# Altium project Dahlia Carrier Board.PrjPcb (part 3 of 4)

## Sheet Ethernet.SchDoc: Dahlia Carrier Board
size A3; Organization: Toradex AG; Address1: Ebenaustrasse 10; Address2: Horw; Address3: 6048; Address4: Switzerland; DocumentNumber: 7; Revision: V1.1; SheetNumber: 7; SheetTotal: 21; PageSetup: Record=PageOptions|CenterHorizontal=True|CenterVertical=True|PrintScale=0.71|XCorrection=1.00|YCorrection=1.00|PrintKind=1|BorderSize=5000000|LeftOffset=0|BottomOffset=0|Orientation=2|PaperLength=1000|PaperWidth=1000|Scale=100|PaperSource=15|PrintQuality=600|MediaType=1|DitherType=10|PaperKind=A4|PrintScaleMode=1
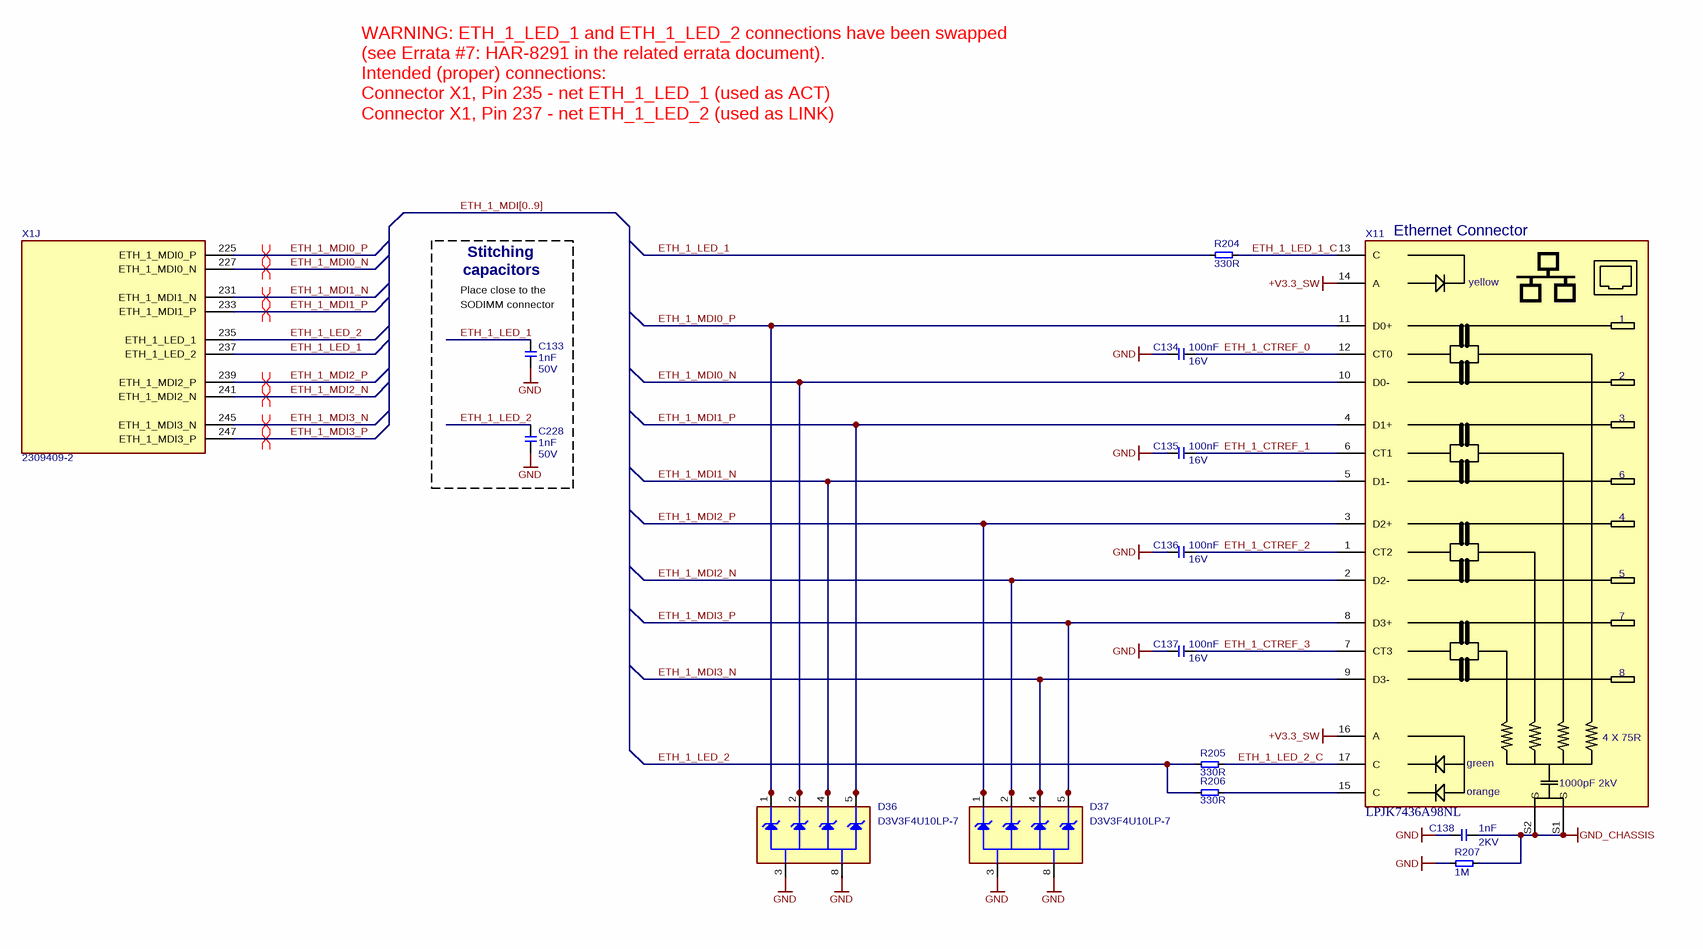
[diagram p10: Ethernet.SchDoc]

### Parts
C133  Rating: 50V  [CAPC1005X60N]  (hidden comment: 1nF)
C134  Rating: 16V  [CAPC1005X60N]  (hidden comment: 100nF)
C135  Rating: 16V  [CAPC1005X60N]  (hidden comment: 100nF)
C136  Rating: 16V  [CAPC1005X60N]  (hidden comment: 100nF)
C137  Rating: 16V  [CAPC1005X60N]  (hidden comment: 100nF)
C138  Rating: 2KV  [T_CAPC1206X180N]  (hidden comment: 1nF)
C228  Rating: 50V  [CAPC1005X60N]  (hidden comment: 1nF)
D36  D3V3F4U10LP-7  [D-Diodes-D3V3F4U10LP-7]
D37  D3V3F4U10LP-7  [D-Diodes-D3V3F4U10LP-7]
R204  330R  [RESC1005X40N]
R205  330R  [RESC1005X40N]
R206  330R  [RESC1005X40N]
R207  1M  [RESC3216X75N]
X1  2309409-2  [CON-TE-2309409-2-SOLDERABLE-STANDOFFS]  (part J of 23)
X11  LPJK7436A98NL  [CON-LINK-PP-LPJK7436A98NL]

### Nets
+V3.3_SW: X11.14(A) X11.16(A)
GND: C133.1 C134.2 C135.2 C136.2 C137.2 C138.1 C228.1 D36.3 D36.8 D37.3 D37.8 R207.2
GND_CHASSIS: C138.2 R207.1 X11.S1(S) X11.S2(S)
ETH_1_CTREF_0: C134.1 X11.12(CT0)
ETH_1_CTREF_1: C135.1 X11.6(CT1)
ETH_1_CTREF_2: C136.1 X11.1(CT2)
ETH_1_CTREF_3: C137.1 X11.7(CT3)
ETH_1_LED_1: C133.2 R204.2 X1.237(ETH_1_LED_2)
ETH_1_LED_1_C: R204.1 X11.13(C)
ETH_1_LED_2: C228.2 R205.2 R206.2 X1.235(ETH_1_LED_1)
ETH_1_LED_2_C: R205.1 X11.17(C)
ETH_1_MDI0_N: D36.2 D36.9 X1.227(ETH_1_MDI0_N) X11.10(D0-)
ETH_1_MDI0_P: D36.1 D36.10 X1.225(ETH_1_MDI0_P) X11.11(D0+)
ETH_1_MDI1_N: D36.4 D36.7 X1.231(ETH_1_MDI1_N) X11.5(D1-)
ETH_1_MDI1_P: D36.5 D36.6 X1.233(ETH_1_MDI1_P) X11.4(D1+)
ETH_1_MDI2_N: D37.2 D37.9 X1.241(ETH_1_MDI2_N) X11.2(D2-)
ETH_1_MDI2_P: D37.1 D37.10 X1.239(ETH_1_MDI2_P) X11.3(D2+)
ETH_1_MDI3_N: D37.4 D37.7 X1.245(ETH_1_MDI3_N) X11.9(D3-)
ETH_1_MDI3_P: D37.5 D37.6 X1.247(ETH_1_MDI3_P) X11.8(D3+)
NetR206_1: R206.1 X11.15(C)

### Buses and harness runs
bus ETH_1_MDI[0..9]

### Layout directives
differential pair; differential pair class LAN: ETH_1_MDI0_N, ETH_1_MDI0_P, ETH_1_MDI1_N, ETH_1_MDI1_P, ETH_1_MDI2_N, ETH_1_MDI2_P, ETH_1_MDI3_N, ETH_1_MDI3_P

### Notes on the sheet
- WARNING: ETH_1_LED_1 and ETH_1_LED_2 connections have been swapped (see Errata #7: HAR-8291 in the related errata document).
  Intended (proper) connections:
  Connector X1, Pin 235 - net ETH_1_LED_1 (used as ACT)
  Connector X1, Pin 237 - net ETH_1_LED_2 (used as LINK)
- (near X11) Ethernet Connector
- (near C133) Place close to the
- (near C133) SODIMM connector
- capacitors
- Stitching
- Title
- Size:
- Date:
- A3
- Number:
- Time:
- Revision:
- Sheet
- of
- File:
- (in symbol CON-ETH-RJ45-1000BaseT) yellow; 4 X 75R; green; 1000pF 2kV; orange

### Library data of the parts
C133 C228 = C-X7R-1nF-50V-10%-0402: Capacitor Ceramic X7R 1nF 50V 10% 0402; Tolerance: 10%; Type: X7R; Value: 1nF
C134-C137 = C-X7R-100nF-16V-10%-0402: Capacitor Ceramic X7R 100nF 16V 10% 0402; Tolerance: 10%; Type: X7R; Value: 100nF
C138 = C-X7R-1nF-2KV-10%-1206: Capacitor Ceramic X7R 1nF 2KV 10% 1206; Tolerance: 10%; Type: X7R; Value: 1nF
D36 D37 = D-Diodes-D3V3F4U10LP-7: as D28 on sheet SDCard; Manufacturer Part No.: D3V3F4U10LP-7
R204-R206 = R-330R-63mW-5%-0402: Resistor 330 ohm 63mW 5% 0402; Rating: 63mW; Tolerance: 5%; Value: 330R
R207 = R-1M-250mW-5%-1206: Resistor 1 Mohm 250mW 5% 1206; Rating: 250mW; Tolerance: 5%; Value: 1M
X1 = CON-TE-2309409-2: as X1 on sheet Power_Switch; Temperature Range: -40C to +125C; Package: DDR4-SODIMM-260; Manufacturer Part No.: 2309409-2
X11 = CON-ETH-RJ45-1000BaseT: 10/100/1000 MBit/s Gigabit Ethernet RJ45 Connector, Low profile, Mag Jack, Temp. Range: -40C to +100C; Manufacturer Name: LINK-PP; Temperature Range: *; Manufacturer Part No.: LPJK7436A98NL

## Sheet PCI_Express.SchDoc: Dahlia Carrier Board
size A3; Organization: Toradex AG; Address1: Ebenaustrasse 10; Address2: Horw; Address3: 6048; Address4: Switzerland; DocumentNumber: 8; Revision: V1.1; SheetNumber: 8; SheetTotal: 21; PageSetup: Record=PageOptions|CenterHorizontal=True|CenterVertical=True|PrintScale=0.71|XCorrection=1.00|YCorrection=1.00|PrintKind=1|BorderSize=5000000|LeftOffset=0|BottomOffset=0|Orientation=2|PaperLength=1000|PaperWidth=1000|Scale=100|PaperSource=15|PrintQuality=600|MediaType=1|DitherType=10|PaperKind=A4|PrintScaleMode=1
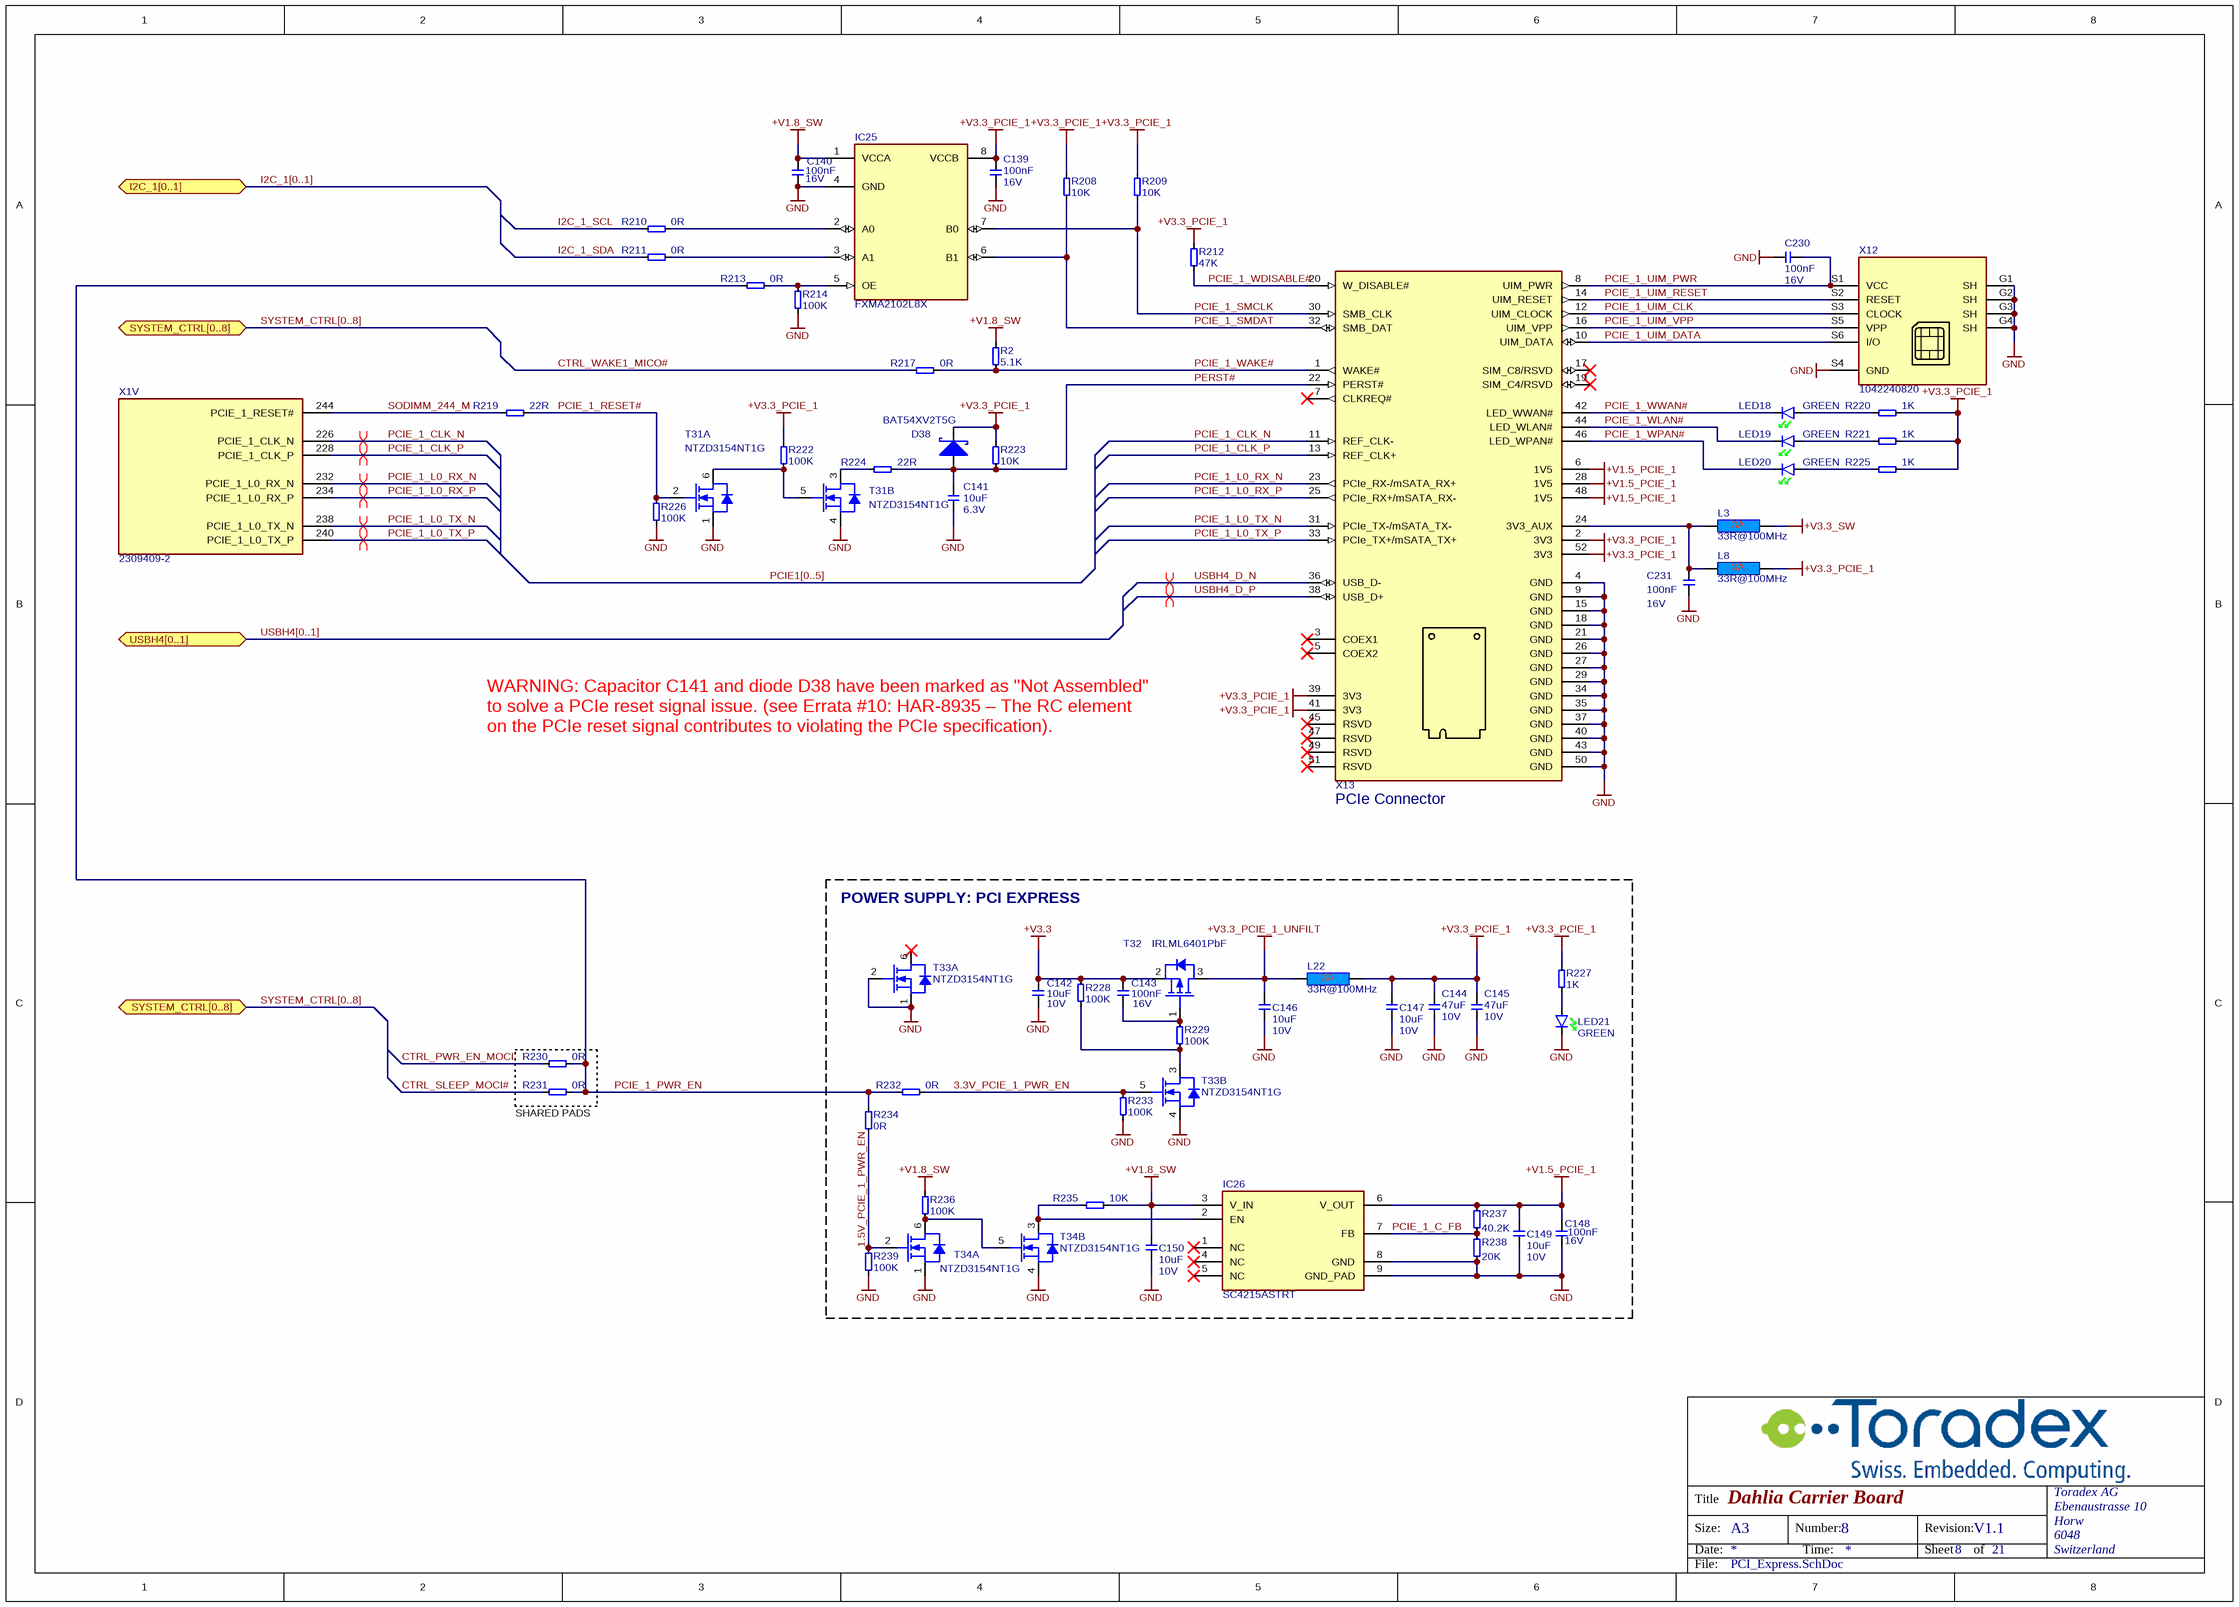
[diagram p11: PCI_Express.SchDoc]

### Parts
C139  Rating: 16V  [CAPC1005X60N]  (hidden comment: 100nF)
C140  Rating: 16V  [CAPC1005X60N]  (hidden comment: 100nF)
C141  Rating: 6.3V  [CAPC1005X60N]  (hidden comment: 10uF)
C142  Rating: 10V  [T_CAPC0603X33N]  (hidden comment: 10uF)
C143  Rating: 16V  [CAPC1005X60N]  (hidden comment: 100nF)
C144  Rating: 10V  [T_CAPC0805X125N]  (hidden comment: 47uF)
C145  Rating: 10V  [T_CAPC0805X125N]  (hidden comment: 47uF)
C146  Rating: 10V  [T_CAPC0603X33N]  (hidden comment: 10uF)
C147  Rating: 10V  [T_CAPC0603X33N]  (hidden comment: 10uF)
C148  Rating: 16V  [CAPC1005X60N]  (hidden comment: 100nF)
C149  Rating: 10V  [T_CAPC0603X33N]  (hidden comment: 10uF)
C150  Rating: 10V  [T_CAPC0603X33N]  (hidden comment: 10uF)
C230  Rating: 16V  [CAPC1005X60N]  (hidden comment: 100nF)
C231  Rating: 16V  [CAPC1005X60N]  (hidden comment: 100nF)
D38  BAT54XV2T5G  [SOD-523]
IC25  FXMA2102L8X  [IC-MicroPak50P160X2160X55-8N]
IC26  Manufacturer Part No.: SC4215ASTRT  [IC-SOIC127P650X175_HS-8N]  (hidden comment: IC-Semtech-SC4215A)
L3  33R@100MHz  [INDC1608X95N]
L8  33R@100MHz  [INDC1608X95N]
L22  33R@100MHz  [INDC1608X95N]
LED18  Color: GREEN  [T_Liteon_LTST-C190GKT]  (hidden comment: LTST-C190GKT)
LED19  Color: GREEN  [T_Liteon_LTST-C190GKT]  (hidden comment: LTST-C190GKT)
LED20  Color: GREEN  [T_Liteon_LTST-C190GKT]  (hidden comment: LTST-C190GKT)
LED21  Color: GREEN  [T_Liteon_LTST-C190GKT]  (hidden comment: LTST-C190GKT)
R2  5.1K  [T_RESC0603X30N]
R208  10K  [RESC1005X40N]
R209  10K  [RESC1005X40N]
R210  0R  [T_RESC0603X30N]
R211  0R  [T_RESC0603X30N]
R212  47K  [RESC1005X40N]
R213  0R  [T_RESC0603X30N]
R214  100K  [RESC1005X40N]
R217  0R  [T_RESC0603X30N]
R219  22R  [RESC1005X40N]
R220  1K  [RESC1005X40N]
R221  1K  [RESC1005X40N]
R222  100K  [RESC1005X40N]
R223  10K  [RESC1005X40N]
R224  22R  [RESC1005X40N]
R225  1K  [RESC1005X40N]
R226  100K  [RESC1005X40N]
R227  1K  [RESC1005X40N]
R228  100K  [RESC1005X40N]
R229  100K  [RESC1005X40N]
R230  0R  [T_RESC0603X30N]
R231  0R  [T_RESC0603X30N]
R232  0R  [T_RESC0603X30N]
R233  100K  [RESC1005X40N]
R234  0R  [T_RESC0603X30N]
R235  10K  [RESC1005X40N]
R236  100K  [RESC1005X40N]
R237  40.2K  [RESC1005X40N]
R238  20K  [RESC1005X40N]
R239  100K  [RESC1005X40N]
T31  Manufacturer Part No.: NTZD3154NT1G  [SOTFL50P160X60-6N]  (hidden comment: T-ONSemi-NTZD3154NT1G)  (parts A,B of 2)
T32  IRLML6401PbF  [SOT95P237X112-3N]
T33  Manufacturer Part No.: NTZD3154NT1G  [SOTFL50P160X60-6N]  (hidden comment: T-ONSemi-NTZD3154NT1G)  (parts A,B of 2)
T34  Manufacturer Part No.: NTZD3154NT1G  [SOTFL50P160X60-6N]  (hidden comment: T-ONSemi-NTZD3154NT1G)  (parts A,B of 2)
X1  2309409-2  [CON-TE-2309409-2-SOLDERABLE-STANDOFFS]  (part V of 23)
X12  1042240820  [T_Molex_1042240820]
X13  67910-5700  [CON-Molex-67910-5700-Half/Full]  (value not drawn)

### Blocks framed on the sheet
POWER SUPPLY: PCI EXPRESS: C142-C150 IC26 L22 LED21 R227-R229 R232-R239 T32-T34

### Ports
I2C_1[0..1] (bidir), SYSTEM_CTRL[0..8] (bidir), USBH4[0..1] (bidir)

### Nets
+V1.5_PCIE_1: C148.2 C149.2 IC26.6(V_OUT) R237.2 X13.6(1V5) X13.28(1V5) X13.48(1V5)
+V1.8_SW: C140.2 C150.2 IC25.1(VCCA) IC26.3(V_IN) R2.1 R235.1 R236.2
+V3.3: C142.2 C143.2 R228.2 T32.2(S)
+V3.3_PCIE_1: C139.2 C144.2 C145.2 C147.2 D38.C IC25.8(VCCB) L8.2 L22.2 R208.2 R209.2 R212.2 R220.1 R221.1 R222.2 R223.2 R225.1 R227.2 X13.2(3V3) X13.39(3V3) X13.41(3V3) X13.52(3V3)
+V3.3_PCIE_1_UNFILT: C146.2 L22.1 T32.3(D)
+V3.3_SW: L3.2
GND: C139.1 C140.1 C141.1 C142.1 C144.1 C145.1 C146.1 C147.1 C148.1 C149.1 C150.1 C230.1 C231.1 IC25.4(GND) IC26.8(GND) IC26.9(GND_PAD) LED21.K R214.1 R226.1 R233.1 R238.1 R239.1 T31.1(S) T31.4(S) T33.1(S) T33.2(G) T33.4(S) T34.1(S) T34.4(S) X12.G1(SH) X12.G2(SH) X12.G3(SH) X12.G4(SH) X12.S4(GND) X13.4(GND) X13.9(GND) X13.15(GND) X13.18(GND) X13.21(GND) X13.26(GND) X13.27(GND) X13.29(GND) X13.34(GND) X13.35(GND) X13.37(GND) X13.40(GND) X13.43(GND) X13.50(GND)
1.5V_PCIE_1_PWR_EN: R234.1 R239.2 T34.2(G)
3.3V_PCIE_1_PWR_EN: R232.2 R233.2 T33.5(G)
CTRL_PWR_EN_MOCI: R230.1
CTRL_SLEEP_MOCI#: R231.1
CTRL_WAKE1_MICO#: R217.1
I2C_1_SCL: R210.1
I2C_1_SDA: R211.1
PCIE_1_C_FB: IC26.7(FB) R237.1 R238.2
PCIE_1_CLK_N: X1.226(PCIE_1_CLK_N) X13.11(REF_CLK-)
PCIE_1_CLK_P: X1.228(PCIE_1_CLK_P) X13.13(REF_CLK+)
PCIE_1_L0_RX_N: X1.232(PCIE_1_L0_RX_N) X13.23(PCIe_RX-/mSATA_RX+)
PCIE_1_L0_RX_P: X1.234(PCIE_1_L0_RX_P) X13.25(PCIe_RX+/mSATA_RX-)
PCIE_1_L0_TX_N: X1.238(PCIE_1_L0_TX_N) X13.31(PCIe_TX-/mSATA_TX-)
PCIE_1_L0_TX_P: X1.240(PCIE_1_L0_TX_P) X13.33(PCIe_TX+/mSATA_TX+)
PCIE_1_PWR_EN: R213.1 R230.2 R231.2 R232.1 R234.2
PCIE_1_RESET#: R219.2 R226.2 T31.2(G)
PCIE_1_SMCLK: IC25.7(B0) R209.1 X13.30(SMB_CLK)
PCIE_1_SMDAT: IC25.6(B1) R208.1 X13.32(SMB_DAT)
PCIE_1_UIM_CLK: X12.S3(CLOCK) X13.12(UIM_CLOCK)
PCIE_1_UIM_DATA: X12.S6(I/O) X13.10(UIM_DATA)
PCIE_1_UIM_PWR: C230.2 X12.S1(VCC) X13.8(UIM_PWR)
PCIE_1_UIM_RESET: X12.S2(RESET) X13.14(UIM_RESET)
PCIE_1_UIM_VPP: X12.S5(VPP) X13.16(UIM_VPP)
PCIE_1_WAKE#: R2.2 R217.2 X13.1(WAKE#)
PCIE_1_WDISABLE#: R212.1 X13.20(W_DISABLE#)
PCIE_1_WLAN#: LED19.K X13.44(LED_WLAN#)
PCIE_1_WPAN#: LED20.K X13.46(LED_WPAN#)
PCIE_1_WWAN#: LED18.K X13.42(LED_WWAN#)
PERST#: C141.2 D38.A R223.1 R224.2 X13.22(PERST#)
SODIMM_244_M: R219.1 X1.244(PCIE_1_RESET#)
USBH4_D_N: X13.36(USB_D-)
USBH4_D_P: X13.38(USB_D+)
NetC143_1: C143.1 R229.2 T32.1(G)
NetC231_2: C231.2 L3.1 L8.1 X13.24(3V3_AUX)
NetIC25_2: IC25.2(A0) R210.2
NetIC25_3: IC25.3(A1) R211.2
NetIC25_5: IC25.5(OE) R213.2 R214.2
NetIC26_2: IC26.2(EN) R235.2 T34.3(D)
NetLED18_A: LED18.A R220.2
NetLED19_A: LED19.A R221.2
NetLED20_A: LED20.A R225.2
NetLED21_A: LED21.A R227.1
NetR222_1: R222.1 T31.5(G) T31.6(D)
NetR224_1: R224.1 T31.3(D)
NetR228_1: R228.1 R229.1 T33.3(D)
NetR236_1: R236.1 T34.5(G) T34.6(D)

Not connected (* = marked no-connect by the designer): IC26 1(NC)* 4(NC)* 5(NC)*; T33 6(D)*; X13 3(COEX1)* 5(COEX2)* 7(CLKREQ#)* 17(SIM_C8/RSVD)* 19(SIM_C4/RSVD)* 45(RSVD)* 47(RSVD)* 49(RSVD)* 51(RSVD)*

### Buses and harness runs
bus I2C_1[0..1] = port I2C_1[0..1]
bus PCIE1[0..5]
bus SYSTEM_CTRL[0..8] = port SYSTEM_CTRL[0..8]
bus USBH4[0..1] = port USBH4[0..1]

### Layout directives
differential pair; differential pair class PCIe: PCIE_1_CLK_N, PCIE_1_CLK_P, PCIE_1_L0_RX_N, PCIE_1_L0_RX_P, PCIE_1_L0_TX_N, PCIE_1_L0_TX_P
differential pair; differential pair class USB: USBH4_D_N, USBH4_D_P

### Notes on the sheet
- WARNING: Capacitor C141 and diode D38 have been marked as "Not Assembled" to solve a PCIe reset signal issue. (see Errata #10: HAR-8935 – The RC element on the PCIe reset signal contributes to violating the PCIe specification).
- (near X13) PCIe Connector
- (near R231) SHARED PADS
- Title
- Size:
- Date:
- A3
- Number:
- Time:
- Revision:
- Sheet
- of
- File:

### Library data of the parts
C139 C140 C143 C148 C230 C231 = C-X7R-100nF-16V-10%-0402: Capacitor Ceramic X7R 100nF 16V 10% 0402; Tolerance: 10%; Type: X7R; Value: 100nF
C141 = C-X5R-10u-6.3V-20%-0402: Capacitor Ceramic X5R 10uF 6.3V 20% 0402; Tolerance: 20%; Type: X5R; Value: 10uF
C142 C146 C147 C149 C150 = C-X5R-10uF-10V-20%-0603: Capacitor Ceramic X5R 10uF 10V 20% 0603; Tolerance: 20%; Type: X5R; Value: 10uF
C144 C145 = C-X5R-47uF-10V-20%-0805: Capacitor Ceramic X5R 47uF 10V 20% 0805; Tolerance: 20%; Type: X5R; Value: 47uF
D38 = D-BAT54-SOD523: Schottky Barrier Rectifier; Manufacturer Name: On Semi; Manufacturer Part No.: BAT54XV2T5G
IC25 = IC-ONsemi-FXMA2102L8X: Voltage Level Translator for I2C Applications; Manufacturer Name: ONSemi; Manufacturer Part No.: FXMA2102L8X
IC26 = IC-Semtech-SC4215A: LDO TO 2A; Manufacturer Name: Semtech; Package: *; Temperature Range: *
L3 L8 L22 = L-33R@100MHz-3A-25%-0603: 33R@100MHz 3A EMI FILTER; Tolerance: 25%; Rating: 3A; Value: 33R@100MHz
LED18-LED21 = LED-LiteOn-LTST-C190GKT: LED green Lite-ON LTST-C190GKT; Manufacturer Name: Lite-ON; Manufacturer Part No.: LTST-C190GKT
R2 = R-5.1K-63mW-1%-0603: Resistor 5.1 Kohm 63mW 1% 0603; Rating: 63mW; Tolerance: 1%; Value: 5.1K
R208 R209 R223 R235 = R-10K-63mW-5%-0402: Resistor 10 Kohm 63mW 5% 0402; Rating: 63mW; Tolerance: 5%; Value: 10K
R210 R211 R213 R217 R230-R232 R234 = R-0R-63mW-1%-0603: Resistor 0 ohm 63mW 1% 0603; Rating: 63mW; Tolerance: 1%; Value: 0R
R212 = R-47K-63mW-1%-0402: Resistor 47 Kohm 63mW 1% 0402; Rating: 63mW; Tolerance: 1%; Value: 47K
R214 R222 R226 R228 R229 R233 R236 R239 = R-100K-63mW-5%-0402: Resistor 100 Kohm 63mW 5% 0402; Rating: 63mW; Tolerance: 5%; Value: 100K
R219 R224 = R-22R-63mW-5%-0402: Resistor 22 ohm 63mW 5% 0402; Rating: 63mW; Tolerance: 5%; Value: 22R
R220 R221 R225 R227 = R-1K-63mW-5%-0402: Resistor 1 Kohm 63mW 5% 0402; Rating: 63mW; Tolerance: 5%; Value: 1K
R237 = R-40.2KR-63mW-1%-0402: Resistor 40.2 Kohm 63mW 1% 0402; Value: 40.2KR; Rating: 63mW; Tolerance: 1%
R238 = R-20KR-63mW-1%-0402: Resistor 20 Kohm 63mW 1% 0402; Value: 20KR; Rating: 63mW; Tolerance: 1%
T31 T33 T34 = T-ONSemi-NTZD3154NT1G: Dual N-Channel 20V (D-S)  MOSFET; Manufacturer Name: ONSemi
T32 = T-IR-IRLML6401PbF-SOT-23: p-channel MOSFET, IRLML6401PbF; Manufacturer Name: International Rectifier; Manufacturer Part No.: IRLML6401PbF
X1 = CON-TE-2309409-2: DDR4 SODIMM Socket, 260 pins, 5.2mm(H), 0.5mm Pitch; Manufacturer Name: TE; Temperature Range: -40C to +125C; Package: DDR4-SODIMM-260; Manufacturer Part No.: 2309409-2
X12 = CON-Molex-1042240820: 6 Contacts Nano Sim Card Holder; Manufacturer Name: Molex; Manufacturer Part No.: 1042240820
X13 = CON-Molex-67910-5700: PCIe_Mini Card Holder; Manufacturer Name: Molex; Manufacturer Part No.: 67910-5700

## Sheet Audio.SchDoc: Dahlia Carrier Board
size A3; Organization: Toradex AG; Address1: Ebenaustrasse 10; Address2: Horw; Address3: 6048; Address4: Switzerland; DocumentNumber: 15; Revision: V1.1; SheetNumber: 15; SheetTotal: 21; PageSetup: Record=PageOptions|CenterHorizontal=True|CenterVertical=True|PrintScale=0.71|XCorrection=1.00|YCorrection=1.00|PrintKind=1|BorderSize=5000000|LeftOffset=0|BottomOffset=0|Orientation=2|PaperLength=1000|PaperWidth=1000|Scale=100|PaperSource=15|PrintQuality=600|MediaType=1|DitherType=10|PaperKind=A4|PrintScaleMode=1
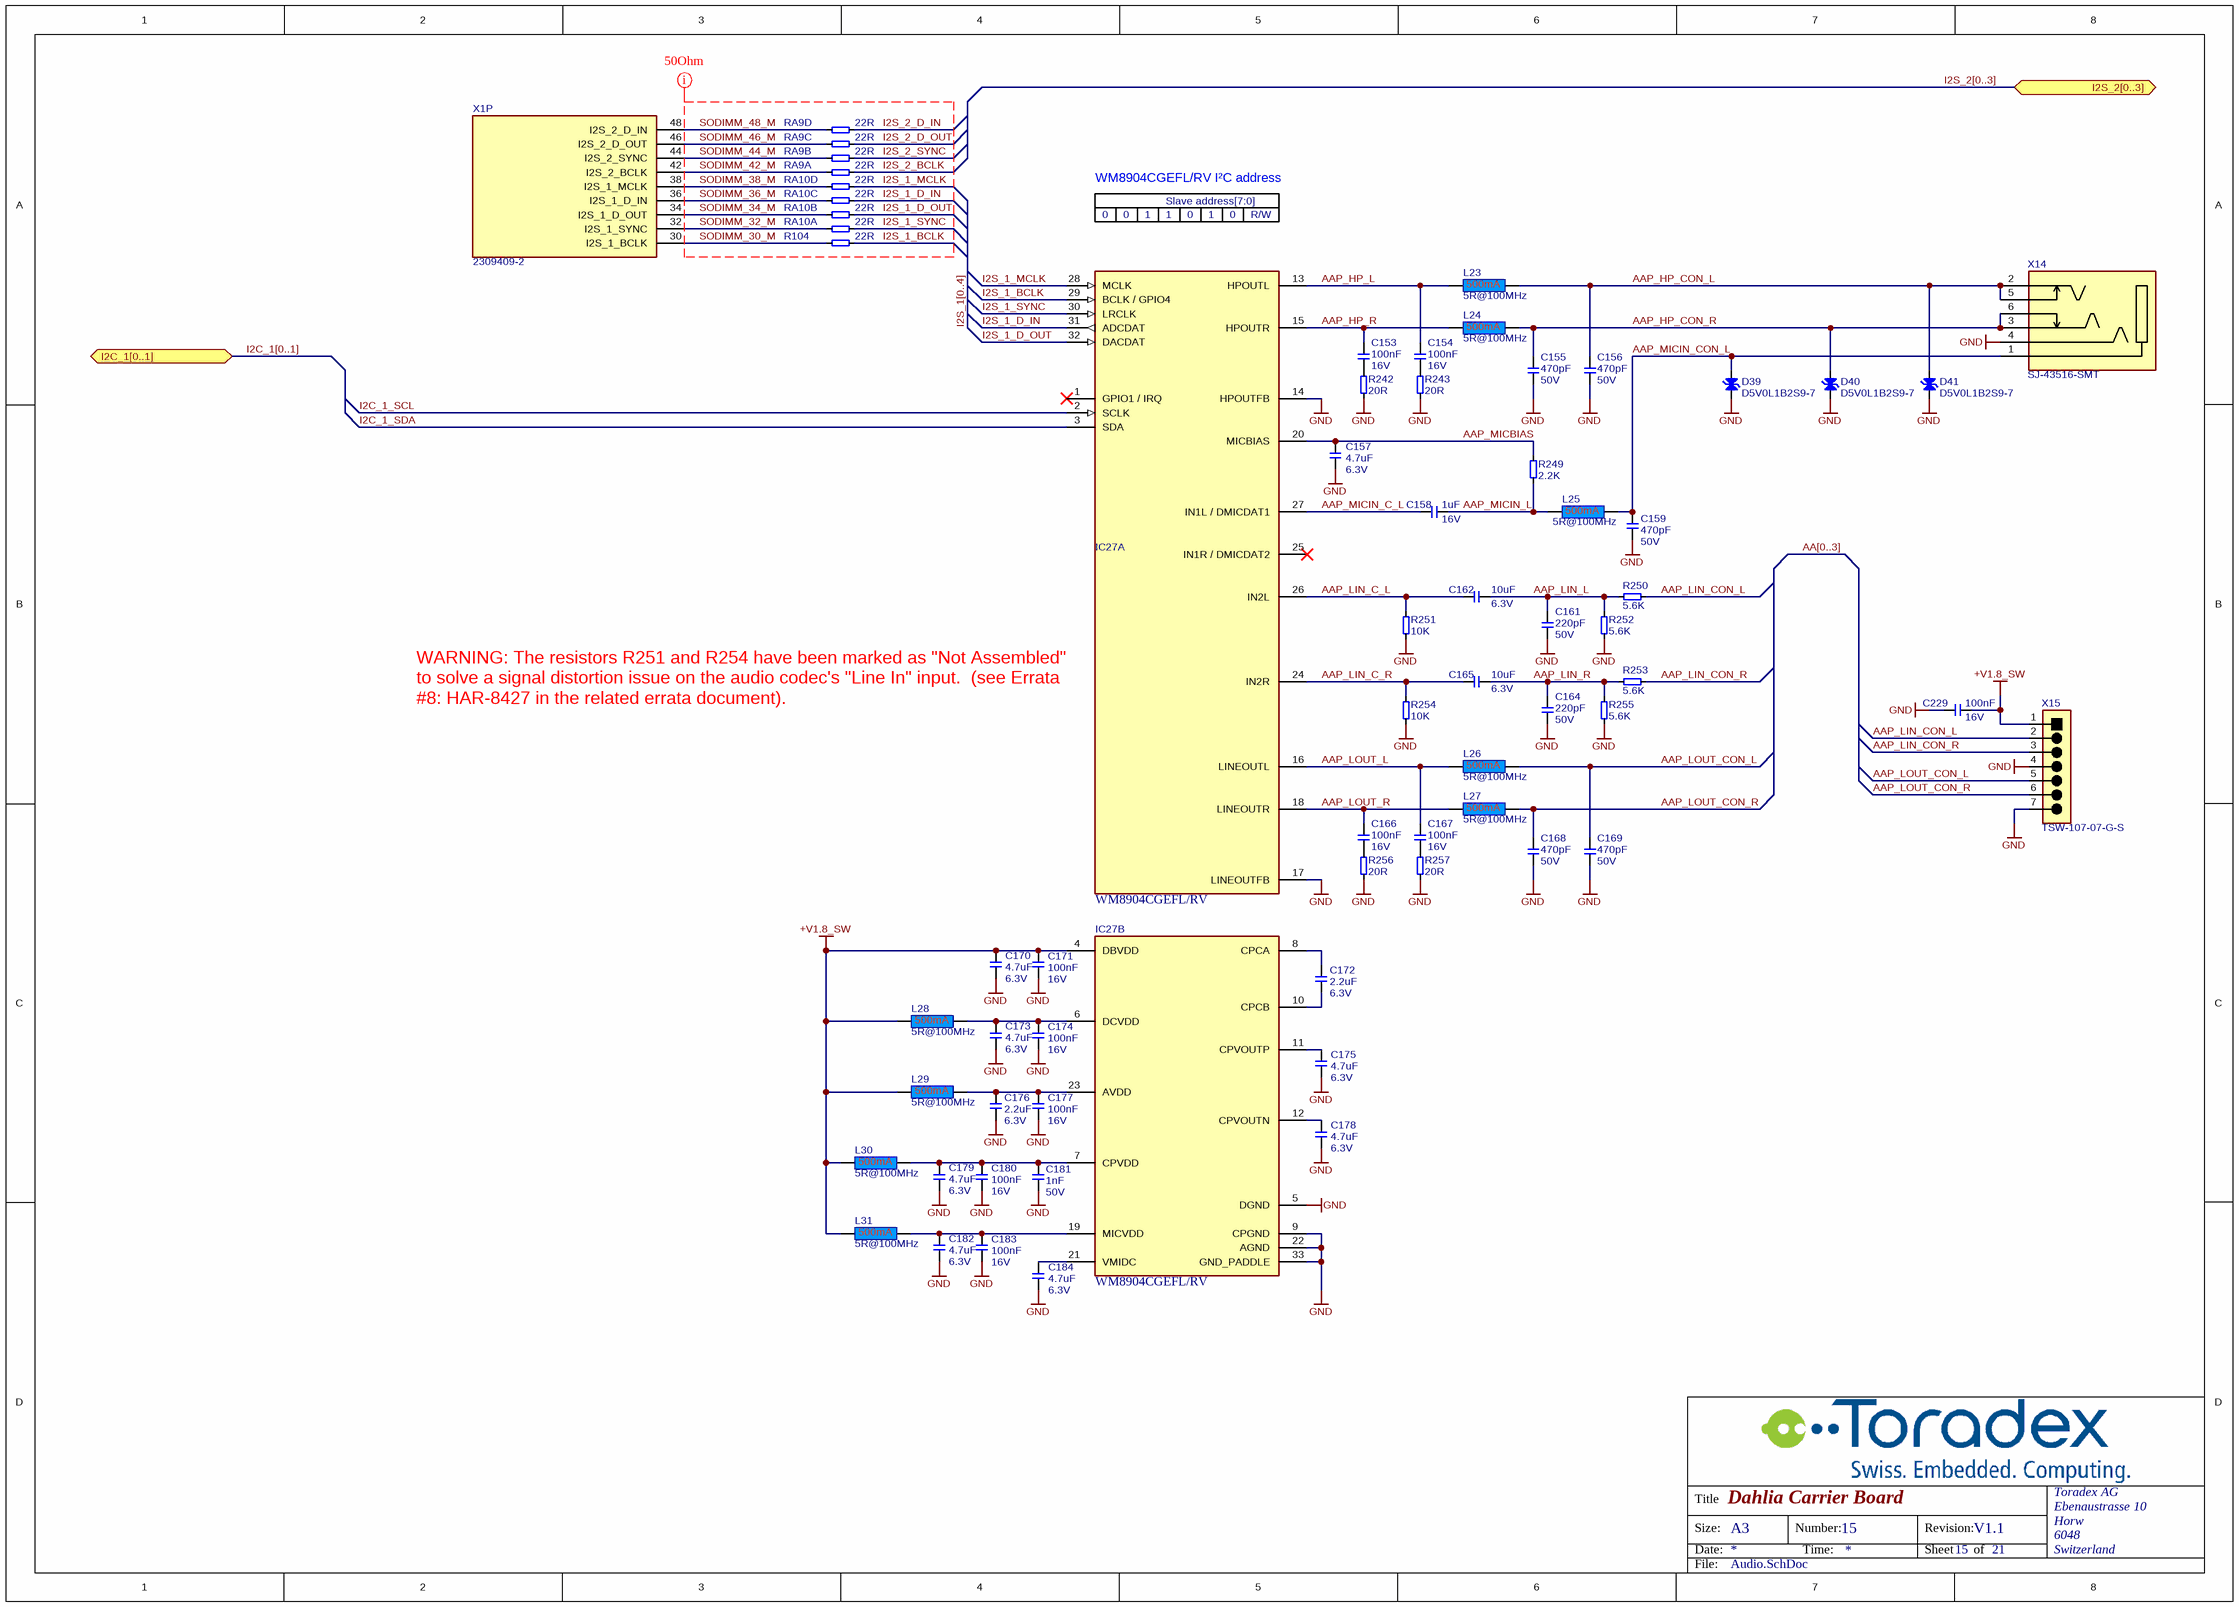
[diagram p12: Audio.SchDoc]

### Parts
C153  Rating: 16V  [CAPC1005X60N]  (hidden comment: 100nF)
C154  Rating: 16V  [CAPC1005X60N]  (hidden comment: 100nF)
C155  Rating: 50V  [CAPC1005X60N]  (hidden comment: 470pF)
C156  Rating: 50V  [CAPC1005X60N]  (hidden comment: 470pF)
C157  Rating: 6.3V  [CAPC1005X60N]  (hidden comment: 4.7uF)
C158  Rating: 16V  [CAPC1005X60N]  (hidden comment: 1uF)
C159  Rating: 50V  [CAPC1005X60N]  (hidden comment: 470pF)
C161  Rating: 50V  [CAPC1005X60N]  (hidden comment: 220pF)
C162  Rating: 6.3V  [CAPC1005X60N]  (hidden comment: 10uF)
C164  Rating: 50V  [CAPC1005X60N]  (hidden comment: 220pF)
C165  Rating: 6.3V  [CAPC1005X60N]  (hidden comment: 10uF)
C166  Rating: 16V  [CAPC1005X60N]  (hidden comment: 100nF)
C167  Rating: 16V  [CAPC1005X60N]  (hidden comment: 100nF)
C168  Rating: 50V  [CAPC1005X60N]  (hidden comment: 470pF)
C169  Rating: 50V  [CAPC1005X60N]  (hidden comment: 470pF)
C170  Rating: 6.3V  [CAPC1005X60N]  (hidden comment: 4.7uF)
C171  Rating: 16V  [CAPC1005X60N]  (hidden comment: 100nF)
C172  Rating: 6.3V  [CAPC1005X60N]  (hidden comment: 2.2uF)
C173  Rating: 6.3V  [CAPC1005X60N]  (hidden comment: 4.7uF)
C174  Rating: 16V  [CAPC1005X60N]  (hidden comment: 100nF)
C175  Rating: 6.3V  [CAPC1005X60N]  (hidden comment: 4.7uF)
C176  Rating: 6.3V  [CAPC1005X60N]  (hidden comment: 2.2uF)
C177  Rating: 16V  [CAPC1005X60N]  (hidden comment: 100nF)
C178  Rating: 6.3V  [CAPC1005X60N]  (hidden comment: 4.7uF)
C179  Rating: 6.3V  [CAPC1005X60N]  (hidden comment: 4.7uF)
C180  Rating: 16V  [CAPC1005X60N]  (hidden comment: 100nF)
C181  Rating: 50V  [CAPC1005X60N]  (hidden comment: 1nF)
C182  Rating: 6.3V  [CAPC1005X60N]  (hidden comment: 4.7uF)
C183  Rating: 16V  [CAPC1005X60N]  (hidden comment: 100nF)
C184  Rating: 6.3V  [CAPC1005X60N]  (hidden comment: 4.7uF)
C229  Rating: 16V  [CAPC1005X60N]  (hidden comment: 100nF)
D39  D5V0L1B2S9-7  [D-DIODES-SOD-923]
D40  D5V0L1B2S9-7  [D-DIODES-SOD-923]
D41  D5V0L1B2S9-7  [D-DIODES-SOD-923]
IC27  WM8904CGEFL/RV  [IC-QFN40P400X400X80_HS-33N]  (parts A,B of 2)
L23  5R@100MHz  [INDC1005X60N]
L24  5R@100MHz  [INDC1005X60N]
L25  5R@100MHz  [INDC1005X60N]
L26  5R@100MHz  [INDC1005X60N]
L27  5R@100MHz  [INDC1005X60N]
L28  5R@100MHz  [INDC1005X60N]
L29  5R@100MHz  [INDC1005X60N]
L30  5R@100MHz  [INDC1005X60N]
L31  5R@100MHz  [INDC1005X60N]
R104  22R  [RESC1005X40N]
R242  20R  [RESC1005X40N]
R243  20R  [RESC1005X40N]
R249  2.2K  [RESC1005X40N]
R250  5.6K  [RESC1005X40N]
R251  10K  [RESC1005X40N]
R252  5.6K  [RESC1005X40N]
R253  5.6K  [RESC1005X40N]
R254  10K  [RESC1005X40N]
R255  5.6K  [RESC1005X40N]
R256  20R  [RESC1005X40N]
R257  20R  [RESC1005X40N]
RA9  22R  [T_Resistor_Array_X4]  (parts A,B,C,D of 4)
RA10  22R  [T_Resistor_Array_X4]  (parts A,B,C,D of 4)
X1  2309409-2  [CON-TE-2309409-2-SOLDERABLE-STANDOFFS]  (part P of 23)
X14  SJ-43516-SMT  [T_CI_SJ-43516-SMT]
X15  TSW-107-07-G-S  [T_Samtec_TSW-107-07-G-S]

### Ports
I2C_1[0..1] (bidir), I2S_2[0..3] (bidir)

### Nets
+V1.8_SW: C170.2 C171.2 C229.1 IC27.4(DBVDD) L28.1 L29.1 L30.1 L31.1 X15.1
GND: C155.1 C156.1 C157.1 C159.1 C161.1 C164.1 C168.1 C169.1 C170.1 C171.1 C173.1 C174.1 C175.1 C176.1 C177.1 C178.1 C179.1 C180.1 C181.1 C182.1 C183.1 C184.1 C229.2 D39.1(C) D40.1(C) D41.1(C) IC27.5(DGND) IC27.9(CPGND) IC27.14(HPOUTFB) IC27.17(LINEOUTFB) IC27.22(AGND) IC27.33(GND_PADDLE) R242.1 R243.1 R251.1 R252.1 R254.1 R255.1 R256.1 R257.1 X14.4 X15.4 X15.7
AAP_HP_CON_L: C156.2 D41.2(A) L23.2 X14.2 X14.5
AAP_HP_CON_R: C155.2 D40.2(A) L24.2 X14.3 X14.6
AAP_HP_L: C154.2 IC27.13(HPOUTL) L23.1
AAP_HP_R: C153.2 IC27.15(HPOUTR) L24.1
AAP_LIN_C_L: C162.2 IC27.26(IN2L) R251.2
AAP_LIN_C_R: C165.2 IC27.24(IN2R) R254.2
AAP_LIN_CON_L: R250.1 X15.2
AAP_LIN_CON_R: R253.1 X15.3
AAP_LIN_L: C161.2 C162.1 R250.2 R252.2
AAP_LIN_R: C164.2 C165.1 R253.2 R255.2
AAP_LOUT_CON_L: C169.2 L26.2 X15.5
AAP_LOUT_CON_R: C168.2 L27.2 X15.6
AAP_LOUT_L: C167.2 IC27.16(LINEOUTL) L26.1
AAP_LOUT_R: C166.2 IC27.18(LINEOUTR) L27.1
AAP_MICBIAS: C157.2 IC27.20(MICBIAS) R249.2
AAP_MICIN_C_L: C158.1 IC27.27(IN1L_/_DMICDAT1)
AAP_MICIN_CON_L: C159.2 D39.2(A) L25.2 X14.1
AAP_MICIN_L: C158.2 L25.1 R249.1
I2C_1_SCL: IC27.2(SCLK)
I2C_1_SDA: IC27.3(SDA)
I2S_1_BCLK: IC27.29(BCLK_/_GPIO4) R104.2
I2S_1_D_IN: IC27.31(ADCDAT) RA10.7
I2S_1_D_OUT: IC27.32(DACDAT) RA10.6
I2S_1_MCLK: IC27.28(MCLK) RA10.8
I2S_1_SYNC: IC27.30(LRCLK) RA10.5
I2S_2_BCLK: RA9.5
I2S_2_D_IN: RA9.8
I2S_2_D_OUT: RA9.7
I2S_2_SYNC: RA9.6
SODIMM_30_M: R104.1 X1.30(I2S_1_BCLK)
SODIMM_32_M: RA10.1 X1.32(I2S_1_SYNC)
SODIMM_34_M: RA10.2 X1.34(I2S_1_D_OUT)
SODIMM_36_M: RA10.3 X1.36(I2S_1_D_IN)
SODIMM_38_M: RA10.4 X1.38(I2S_1_MCLK)
SODIMM_42_M: RA9.1 X1.42(I2S_2_BCLK)
SODIMM_44_M: RA9.2 X1.44(I2S_2_SYNC)
SODIMM_46_M: RA9.3 X1.46(I2S_2_D_OUT)
SODIMM_48_M: RA9.4 X1.48(I2S_2_D_IN)
NetC153_1: C153.1 R242.2
NetC154_1: C154.1 R243.2
NetC166_1: C166.1 R256.2
NetC167_1: C167.1 R257.2
NetC172_1: C172.1 IC27.10(CPCB)
NetC172_2: C172.2 IC27.8(CPCA)
NetC173_2: C173.2 C174.2 IC27.6(DCVDD) L28.2
NetC175_2: C175.2 IC27.11(CPVOUTP)
NetC176_2: C176.2 C177.2 IC27.23(AVDD) L29.2
NetC178_2: C178.2 IC27.12(CPVOUTN)
NetC179_2: C179.2 C180.2 C181.2 IC27.7(CPVDD) L30.2
NetC182_2: C182.2 C183.2 IC27.19(MICVDD) L31.2
NetC184_2: C184.2 IC27.21(VMIDC)

Not connected (* = marked no-connect by the designer): IC27 1(GPIO1_/_IRQ)* 25(IN1R_/_DMICDAT2)*

### Buses and harness runs
bus AA[0..3]
bus I2C_1[0..1] = port I2C_1[0..1]
bus I2S_1[0..4]
bus I2S_2[0..3] = port I2S_2[0..3]

### Layout directives
net class 50Ohm: I2S_1_BCLK, I2S_1_D_IN, I2S_1_D_OUT, I2S_1_MCLK, I2S_1_SYNC, I2S_2_BCLK, I2S_2_D_IN, I2S_2_D_OUT, I2S_2_SYNC, SODIMM_30_M, SODIMM_32_M, SODIMM_34_M, SODIMM_36_M, SODIMM_38_M, SODIMM_42_M, SODIMM_44_M, SODIMM_46_M, SODIMM_48_M

### Notes on the sheet
- WM8904CGEFL/RV I²C address
- Slave address[7:0]
- 0
- 1
- R/W
- (near IC27) WARNING: The resistors R251 and R254 have been marked as "Not Assembled" to solve a signal distortion issue on the audio codec's "Line In" input.  (see Errata #8: HAR-8427 in the related errata document).
- Title
- Size:
- Date:
- A3
- Number:
- Time:
- Revision:
- Sheet
- of
- File:

### Library data of the parts
C153 C154 C166 C167 C171 C174 C177 C180 C183 C229 = C-X7R-100nF-16V-10%-0402: Capacitor Ceramic X7R 100nF 16V 10% 0402; Tolerance: 10%; Type: X7R; Value: 100nF
C155 C156 C159 C168 C169 = C-X7R-470p-50V-10%-0402: Capacitor Ceramic X7R 470pF 50V 10% 0402; Tolerance: 10%; Type: X7R; Value: 470pF
C157 C170 C173 C175 C178 C179 C182 C184 = C-X5R-4.7u-6.3V-20%-0402: Capacitor Ceramic X5R 4.7uF 6.3V 20% 0402; Tolerance: 20%; Type: X5R; Value: 4.7uF
C158 = C-X5R-1uF-16V-20%-0402: Capacitor Ceramic X5R 1uF 16V 20% 0402; Tolerance: 20%; Type: X5R; Value: 1uF
C161 C164 = C-X7R-220pF-50V-10%-0402: Capacitor Ceramic X7R  220pF 50V 10% 0402; Tolerance: 10%; Type: X7R; Value: 220pF
C162 C165 = C-X5R-10u-6.3V-20%-0402: Capacitor Ceramic X5R 10uF 6.3V 20% 0402; Tolerance: 20%; Type: X5R; Value: 10uF
C172 C176 = C-X5R-2.2u-6.3V-20%-0402: Capacitor Ceramic X5R 2.2uF 6.3V 20% 0402; Tolerance: 20%; Type: X5R; Value: 2.2uF
C181 = C-X7R-1nF-50V-10%-0402: Capacitor Ceramic X7R 1nF 50V 10% 0402; Tolerance: 10%; Type: X7R; Value: 1nF
D39-D41 = D-Diodes-D5V0L1B2S9-7: BIDIRECTIONAL TVS DIODE 5V  SOD923; Manufacturer Name: Diodes; Manufacturer Part No.: D5V0L1B2S9-7
IC27 = IC-CIRRUS-WM8904CGEFL/RV: Stereo Audio Interface IC; Manufacturer Name: CIRRUS; Package: *; Temperature Range: *; Manufacturer Part No.: WM8904CGEFL/RV
L23-L31 = Lemv-5R-500mA-25%-0402: 5R@100MHz 500mA EMI FILTER; Manufacturer Part No.: BLM15BB050SN1D; Manufacturer: Murata; Tolerance: 25%; Rating: 500mA; Value: 5R@100MHz
R104 = R-22R-63mW-5%-0402: Resistor 22 ohm 63mW 5% 0402; Rating: 63mW; Tolerance: 5%; Value: 22R
R242 R243 R256 R257 = R-20R-63mW-5%-0402: Resistor 20 ohm 63mW 5% 0402; Rating: 63mW; Tolerance: 5%; Value: 20R
R249 = R-2.2K-63mW-5%-0402: Resistor 2.2 Kohm 63mW 5% 0402; Value: 2.2KR; Rating: 63mW; Tolerance: 5%
R250 R252 R253 R255 = R-5.6K-63mW-5%-0402: Resistor 5.6 Kohm 63mW 5% 0402; Value: 5.6KR; Rating: 63mW; Tolerance: 5%
R251 R254 = R-10K-63mW-5%-0402: Resistor 10 Kohm 63mW 5% 0402; Rating: 63mW; Tolerance: 5%; Value: 10K
RA9 RA10 = RA-22R-63mW-5%-1206-div: Resistor Array 22 R 63mW 5% 1206; Tolerance: 5%; Power Dissipation: 63mW; Value: 22R
X1 = CON-TE-2309409-2: as X1 on sheet PCI_Express; Temperature Range: -40C to +125C; Package: DDR4-SODIMM-260; Manufacturer Part No.: 2309409-2
X14 = CON-Cui-SJ-43516-SMT-6-3.5mm: 3.5mm Stereo Jack SMD With Detect Contact; Manufacturer Name: Cui INC; No. of ways: 6; Manufacturer Part No.: SJ-43516-SMT
X15 = CON-Samtec-TSW-107-07-G-S: Header male, 1X7 Pins, 2.54 mm pitch; Manufacturer Name: Samtec; Pitch: 2.54 mm; No. of ways: 1X7; Manufacturer Part No.: TSW-107-07-G-S

## Sheet MIPI-DSI.SchDoc: Dahlia Carrier Board
size A3; Organization: Toradex AG; Address1: Ebenaustrasse 10; Address2: Horw; Address3: 6048; Address4: Switzerland; DocumentNumber: 10; Revision: V1.1; SheetNumber: 10; SheetTotal: 21; PageSetup: Record=PageOptions|CenterHorizontal=True|CenterVertical=True|PrintScale=0.71|XCorrection=1.00|YCorrection=1.00|PrintKind=1|BorderSize=5000000|LeftOffset=0|BottomOffset=0|Orientation=2|PaperLength=1000|PaperWidth=1000|Scale=100|PaperSource=15|PrintQuality=600|MediaType=1|DitherType=10|PaperKind=A4|PrintScaleMode=1
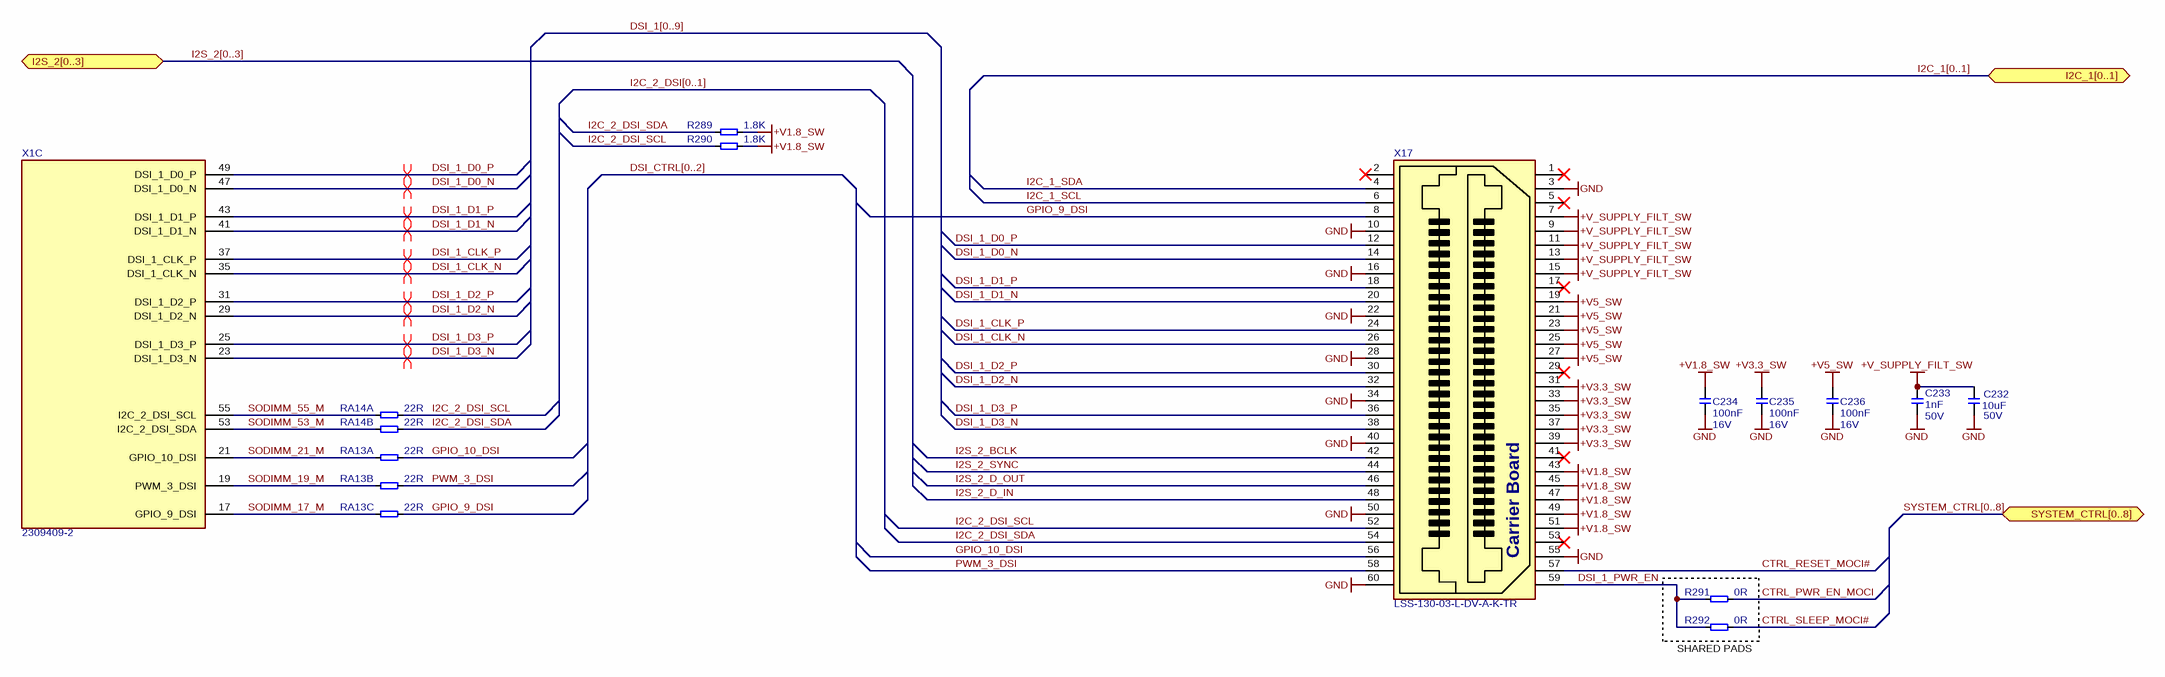
[diagram p13: MIPI-DSI.SchDoc]

### Parts
C232  Rating: 50V  [T_CAPC1206X60N]  (hidden comment: 10uF)
C233  Rating: 50V  [CAPC1005X60N]  (hidden comment: 1nF)
C234  Rating: 16V  [CAPC1005X60N]  (hidden comment: 100nF)
C235  Rating: 16V  [CAPC1005X60N]  (hidden comment: 100nF)
C236  Rating: 16V  [CAPC1005X60N]  (hidden comment: 100nF)
R289  1.8K  [RESC1005X40N]
R290  1.8K  [RESC1005X40N]
R291  0R  [T_RESC0603X30N]
R292  0R  [T_RESC0603X30N]
RA13  22R  [T_Resistor_Array_X4]  (parts A,B,C of 4)
RA14  22R  [T_Resistor_Array_X4]  (parts A,B of 4)
X1  2309409-2  [CON-TE-2309409-2-SOLDERABLE-STANDOFFS]  (part C of 23)
X17  LSS-130-03-L-DV-A-K-TR  [CON-SAMTEC-LSS-130-03-L-DV-A-CARRIER]

### Ports
I2C_1[0..1] (bidir), I2S_2[0..3] (bidir), SYSTEM_CTRL[0..8] (bidir)

### Nets
+V1.8_SW: C234.2 R289.1 R290.1 X17.43 X17.45 X17.47 X17.49 X17.51
+V3.3_SW: C235.2 X17.31 X17.33 X17.35 X17.37 X17.39
+V5_SW: C236.2 X17.19 X17.21 X17.23 X17.25 X17.27
+V_SUPPLY_FILT_SW: C232.2 C233.2 X17.7 X17.9 X17.11 X17.13 X17.15
GND: C232.1 C233.1 C234.1 C235.1 C236.1 X17.3 X17.10 X17.16 X17.22 X17.28 X17.34 X17.40 X17.50 X17.55 X17.60
CTRL_PWR_EN_MOCI: R291.2
CTRL_RESET_MOCI#: X17.57
CTRL_SLEEP_MOCI#: R292.2
DSI_1_CLK_N: X1.35(DSI_1_CLK_N) X17.26
DSI_1_CLK_P: X1.37(DSI_1_CLK_P) X17.24
DSI_1_D0_N: X1.47(DSI_1_D0_N) X17.14
DSI_1_D0_P: X1.49(DSI_1_D0_P) X17.12
DSI_1_D1_N: X1.41(DSI_1_D1_N) X17.20
DSI_1_D1_P: X1.43(DSI_1_D1_P) X17.18
DSI_1_D2_N: X1.29(DSI_1_D2_N) X17.32
DSI_1_D2_P: X1.31(DSI_1_D2_P) X17.30
DSI_1_D3_N: X1.23(DSI_1_D3_N) X17.38
DSI_1_D3_P: X1.25(DSI_1_D3_P) X17.36
DSI_1_PWR_EN: R291.1 R292.1 X17.59
GPIO_9_DSI: RA13.7 X17.8
GPIO_10_DSI: RA13.5 X17.56
I2C_1_SCL: X17.6
I2C_1_SDA: X17.4
I2C_2_DSI_SCL: R290.2 RA14.5 X17.52
I2C_2_DSI_SDA: R289.2 RA14.6 X17.54
I2S_2_BCLK: X17.42
I2S_2_D_IN: X17.48
I2S_2_D_OUT: X17.46
I2S_2_SYNC: X17.44
PWM_3_DSI: RA13.6 X17.58
SODIMM_17_M: RA13.3 X1.17(GPIO_9_DSI)
SODIMM_19_M: RA13.2 X1.19(PWM_3_DSI)
SODIMM_21_M: RA13.1 X1.21(GPIO_10_DSI)
SODIMM_53_M: RA14.2 X1.53(I2C_2_DSI_SDA)
SODIMM_55_M: RA14.1 X1.55(I2C_2_DSI_SCL)

Not connected (* = marked no-connect by the designer): X17 1* 2* 5* 17* 29* 41* 53*

### Buses and harness runs
bus DSI_1[0..9]
bus DSI_CTRL[0..2]
bus I2C_1[0..1] = port I2C_1[0..1]
bus I2C_2_DSI[0..1]
bus I2S_2[0..3] = port I2S_2[0..3]
bus SYSTEM_CTRL[0..8] = port SYSTEM_CTRL[0..8]

### Layout directives
differential pair; differential pair class DSI: DSI_1_CLK_N, DSI_1_CLK_P, DSI_1_D0_N, DSI_1_D0_P, DSI_1_D1_N, DSI_1_D1_P, DSI_1_D2_N, DSI_1_D2_P, DSI_1_D3_N, DSI_1_D3_P

### Notes on the sheet
- (near R292) SHARED PADS
- Title
- Size:
- Date:
- A3
- Number:
- Time:
- Revision:
- Sheet
- of
- File:
- (in symbol CON-Samtec-LSS-130-03-L-DV-A-K-TR-CARRIER) Carrier Board

### Library data of the parts
C232 = C-X5R-10uF-50V-20%-1206: Capacitor Ceramic X5R 10uF 50V 20% 1206; Tolerance: 20%; Type: X5R; Value: 10uF
C233 = C-X7R-1nF-50V-10%-0402: Capacitor Ceramic X7R 1nF 50V 10% 0402; Tolerance: 10%; Type: X7R; Value: 1nF
C234-C236 = C-X7R-100nF-16V-10%-0402: Capacitor Ceramic X7R 100nF 16V 10% 0402; Tolerance: 10%; Type: X7R; Value: 100nF
R289 R290 = R-1.8K-63mW-5%-0402: Resistor 1.8 Kohm 63mW 5% 0402; Rating: 63mW; Tolerance: 5%; Value: 1.8K
R291 R292 = R-0R-63mW-1%-0603: Resistor 0 ohm 63mW 1% 0603; Rating: 63mW; Tolerance: 1%; Value: 0R
RA13 RA14 = RA-22R-63mW-5%-1206-div: Resistor Array 22 R 63mW 5% 1206; Tolerance: 5%; Power Dissipation: 63mW; Value: 22R
X1 = CON-TE-2309409-2: as X1 on sheet PCI_Express; Temperature Range: -40C to +125C; Package: DDR4-SODIMM-260; Manufacturer Part No.: 2309409-2
X17 = CON-Samtec-LSS-130-03-L-DV-A-K-TR-CARRIER: 60 Position Connector, Self Mating, Non-Gendered, Surface Mount; Manufacturer Name: Samtec; Pitch: 0.635mm; No. of ways: 60; Manufacturer Part No.: LSS-130-03-L-DV-A-K-TR

## Sheet MIPI-CSI.SchDoc: Dahlia Carrier Board
size A3; Organization: Toradex AG; Address1: Ebenaustrasse 10; Address2: Horw; Address3: 6048; Address4: Switzerland; DocumentNumber: 11; Revision: V1.1; SheetNumber: 11; SheetTotal: 21; PageSetup: Record=PageOptions|CenterHorizontal=True|CenterVertical=True|PrintScale=0.71|XCorrection=1.00|YCorrection=1.00|PrintKind=1|BorderSize=5000000|LeftOffset=0|BottomOffset=0|Orientation=2|PaperLength=1000|PaperWidth=1000|Scale=100|PaperSource=15|PrintQuality=600|MediaType=1|DitherType=10|PaperKind=A4|PrintScaleMode=1
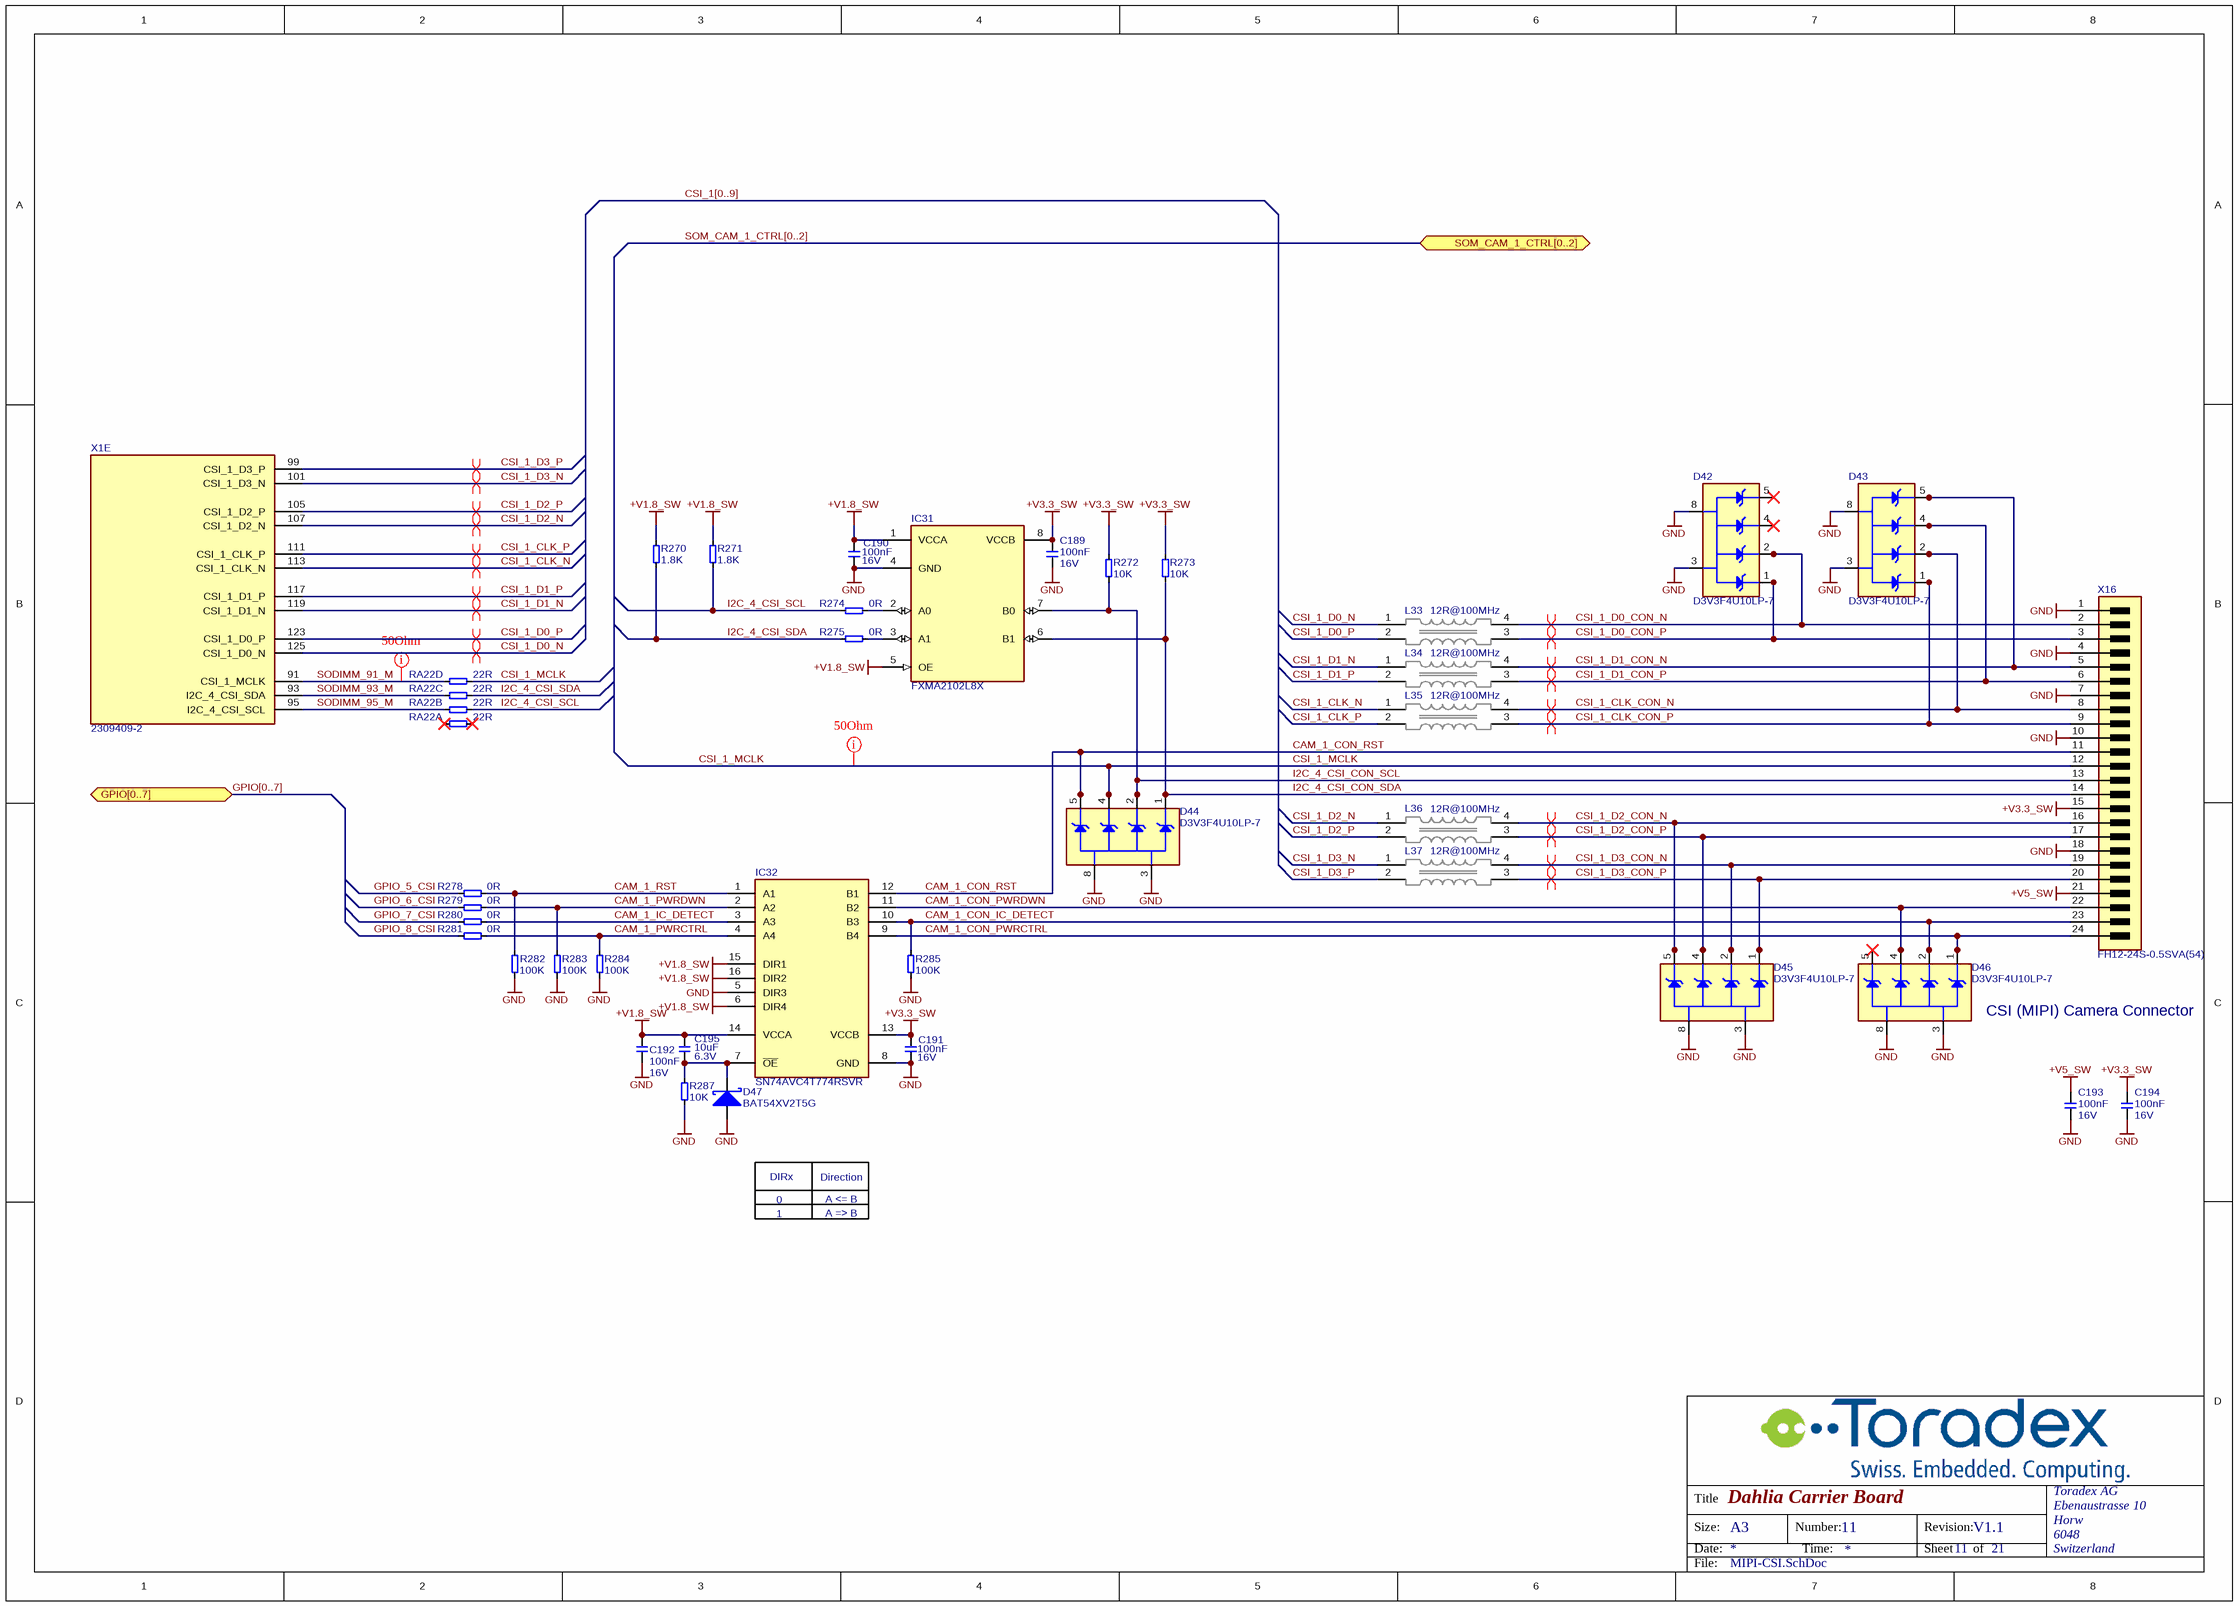
[diagram p14: MIPI-CSI.SchDoc]

### Parts
C189  Rating: 16V  [CAPC1005X60N]  (hidden comment: 100nF)
C190  Rating: 16V  [CAPC1005X60N]  (hidden comment: 100nF)
C191  Rating: 16V  [CAPC1005X60N]  (hidden comment: 100nF)
C192  Rating: 16V  [CAPC1005X60N]  (hidden comment: 100nF)
C193  Rating: 16V  [CAPC1005X60N]  (hidden comment: 100nF)
C194  Rating: 16V  [CAPC1005X60N]  (hidden comment: 100nF)
C195  Rating: 6.3V  [CAPC1005X60N]  (hidden comment: 10uF)
D42  D3V3F4U10LP-7  [D-Diodes-D3V3F4U10LP-7]
D43  D3V3F4U10LP-7  [D-Diodes-D3V3F4U10LP-7]
D44  D3V3F4U10LP-7  [D-Diodes-D3V3F4U10LP-7]
D45  D3V3F4U10LP-7  [D-Diodes-D3V3F4U10LP-7]
D46  D3V3F4U10LP-7  [D-Diodes-D3V3F4U10LP-7]
D47  BAT54XV2T5G  [SOD-523]
IC31  FXMA2102L8X  [IC-MicroPak50P160X2160X55-8N]
IC32  SN74AVC4T774RSVR  [IC-UQFN40P180X210X55-16N]
L33  12R@100MHz  [T_Panasonic_EXC14CH120U]
L34  12R@100MHz  [T_Panasonic_EXC14CH120U]
L35  12R@100MHz  [T_Panasonic_EXC14CH120U]
L36  12R@100MHz  [T_Panasonic_EXC14CH120U]
L37  12R@100MHz  [T_Panasonic_EXC14CH120U]
R270  1.8K  [RESC1005X40N]
R271  1.8K  [RESC1005X40N]
R272  10K  [RESC1005X40N]
R273  10K  [RESC1005X40N]
R274  0R  [T_RESC0603X30N]
R275  0R  [T_RESC0603X30N]
R278  0R  [T_RESC0603X30N]
R279  0R  [T_RESC0603X30N]
R280  0R  [T_RESC0603X30N]
R281  0R  [T_RESC0603X30N]
R282  100K  [RESC1005X40N]
R283  100K  [RESC1005X40N]
R284  100K  [RESC1005X40N]
R285  100K  [RESC1005X40N]
R287  10K  [RESC1005X40N]
RA22  22R  [T_Resistor_Array_X4]  (parts A,B,C,D of 4)
X1  2309409-2  [CON-TE-2309409-2-SOLDERABLE-STANDOFFS]  (part E of 23)
X16  FH12-24S-0.5SVA(54)  [T_Hirose_FH12-24S-0.5SVA(54)]

### Ports
GPIO[0..7] (bidir), SOM_CAM_1_CTRL[0..2] (bidir)

### Nets
+V1.8_SW: C190.2 C192.2 C195.2 IC31.1(VCCA) IC31.5(OE) IC32.6(DIR4) IC32.14(VCCA) IC32.15(DIR1) IC32.16(DIR2) R270.1 R271.1
+V3.3_SW: C189.2 C191.2 C194.2 IC31.8(VCCB) IC32.13(VCCB) R272.2 R273.2 X16.15(DDC_CLK)
+V5_SW: C193.2 X16.21(GND)
GND: C189.1 C190.1 C191.1 C192.1 C193.1 C194.1 D42.3 D42.8 D43.3 D43.8 D44.3 D44.8 D45.3 D45.8 D46.3 D46.8 D47.A IC31.4(GND) IC32.5(DIR3) IC32.8(GND) R282.2 R283.2 R284.2 R285.1 R287.1 X16.1(GND) X16.4(GND) X16.7(GND) X16.10(GND) X16.18(CRT_RED)
CAM_1_CON_IC_DETECT: D46.2 D46.9 IC32.10(B3) R285.2 X16.23(CRT_VSYNC)
CAM_1_CON_PWRCTRL: D46.1 D46.10 IC32.9(B4) X16.24(CRT_HSYNC)
CAM_1_CON_PWRDWN: D46.4 D46.7 IC32.11(B2) X16.22(CRT_BLUE)
CAM_1_CON_RST: D44.5 D44.6 IC32.12(B1) X16.11(TMDS_DATA2_P)
CAM_1_IC_DETECT: IC32.3(A3) R280.1
CAM_1_PWRCTRL: IC32.4(A4) R281.1 R284.1
CAM_1_PWRDWN: IC32.2(A2) R279.1 R283.1
CAM_1_RST: IC32.1(A1) R278.1 R282.1
CSI_1_CLK_CON_N: D43.2 D43.9 L35.4 X16.8(TMDS_DATA1_P)
CSI_1_CLK_CON_P: D43.1 D43.10 L35.3 X16.9(TMDS_DATA1_N)
CSI_1_CLK_N: L35.1 X1.113(CSI_1_CLK_N)
CSI_1_CLK_P: L35.2 X1.111(CSI_1_CLK_P)
CSI_1_D0_CON_N: D42.2 D42.9 L33.4 X16.2(TMDS_CLK_P)
CSI_1_D0_CON_P: D42.1 D42.10 L33.3 X16.3(TMDS_CLK_N)
CSI_1_D0_N: L33.1 X1.125(CSI_1_D0_N)
CSI_1_D0_P: L33.2 X1.123(CSI_1_D0_P)
CSI_1_D1_CON_N: D43.5 D43.6 L34.4 X16.5(TMDS_DATA0_P)
CSI_1_D1_CON_P: D43.4 D43.7 L34.3 X16.6(TMDS_DATA0_N)
CSI_1_D1_N: L34.1 X1.119(CSI_1_D1_N)
CSI_1_D1_P: L34.2 X1.117(CSI_1_D1_P)
CSI_1_D2_CON_N: D45.5 D45.6 L36.4 X16.16(DDC_DATA)
CSI_1_D2_CON_P: D45.4 D45.7 L36.3 X16.17(GND)
CSI_1_D2_N: L36.1 X1.107(CSI_1_D2_N)
CSI_1_D2_P: L36.2 X1.105(CSI_1_D2_P)
CSI_1_D3_CON_N: D45.2 D45.9 L37.4 X16.19(GND)
CSI_1_D3_CON_P: D45.1 D45.10 L37.3 X16.20(CRT_GREEN)
CSI_1_D3_N: L37.1 X1.101(CSI_1_D3_N)
CSI_1_D3_P: L37.2 X1.99(CSI_1_D3_P)
CSI_1_MCLK: D44.4 D44.7 RA22.8 X16.12(TMDS_DATA2_N)
GPIO_5_CSI: R278.2
GPIO_6_CSI: R279.2
GPIO_7_CSI: R280.2
GPIO_8_CSI: R281.2
I2C_4_CSI_CON_SCL: D44.2 D44.9 IC31.7(B0) R272.1 X16.13(VDD)
I2C_4_CSI_CON_SDA: D44.1 D44.10 IC31.6(B1) R273.1 X16.14(HOTPLUG_DETECT)
I2C_4_CSI_SCL: R271.2 R274.2 RA22.6
I2C_4_CSI_SDA: R270.2 R275.2 RA22.7
SODIMM_91_M: RA22.4 X1.91(CSI_1_MCLK)
SODIMM_93_M: RA22.3 X1.93(I2C_4_CSI_SDA)
SODIMM_95_M: RA22.2 X1.95(I2C_4_CSI_SCL)
NetC195_1: C195.1 D47.C IC32.7(~{OE}) R287.2
NetD42_4: D42.4 D42.7
NetD42_5: D42.5 D42.6
NetD46_5: D46.5 D46.6
NetIC31_2: IC31.2(A0) R274.1
NetIC31_3: IC31.3(A1) R275.1

Not connected (* = marked no-connect by the designer): RA22 1* 5*

### Buses and harness runs
bus CSI_1[0..9]
bus GPIO[0..7] = port GPIO[0..7]
bus SOM_CAM_1_CTRL[0..2] = port SOM_CAM_1_CTRL[0..2]

### Layout directives
differential pair; differential pair class CSI: CSI_1_CLK_CON_N, CSI_1_CLK_CON_P, CSI_1_CLK_N, CSI_1_CLK_P, CSI_1_D0_CON_N, CSI_1_D0_CON_P, CSI_1_D0_N, CSI_1_D0_P, CSI_1_D1_CON_N, CSI_1_D1_CON_P, CSI_1_D1_N, CSI_1_D1_P, CSI_1_D2_CON_N, CSI_1_D2_CON_P, CSI_1_D2_N, CSI_1_D2_P, CSI_1_D3_CON_N, CSI_1_D3_CON_P, CSI_1_D3_N, CSI_1_D3_P
net class 50Ohm: CSI_1_MCLK, SODIMM_91_M

### Notes on the sheet
- (near D46) CSI (MIPI) Camera Connector
- DIRx
- 0
- Direction
- A <= B
- 1
- A => B
- Title
- Size:
- Date:
- A3
- Number:
- Time:
- Revision:
- Sheet
- of
- File:

### Library data of the parts
C189-C194 = C-X7R-100nF-16V-10%-0402: Capacitor Ceramic X7R 100nF 16V 10% 0402; Tolerance: 10%; Type: X7R; Value: 100nF
C195 = C-X5R-10u-6.3V-20%-0402: Capacitor Ceramic X5R 10uF 6.3V 20% 0402; Tolerance: 20%; Type: X5R; Value: 10uF
D42-D46 = D-Diodes-D3V3F4U10LP-7: 4 CHANNEL LOW CAPACITANCE TVS DIODE ARRAY; Manufacturer Name: Nexperia; Manufacturer Part No.: D3V3F4U10LP-7
D47 = D-BAT54-SOD523: as D38 on sheet PCI_Express; Manufacturer Part No.: BAT54XV2T5G
IC31 = IC-ONsemi-FXMA2102L8X: as IC25 on sheet PCI_Express; Manufacturer Part No.: FXMA2102L8X
IC32 = IC-TI-SN74AVC4T774RSVR: 4 Bit Bidirectional l Voltage Level Translator, Configurable Direction, UFQFN-16 package; Manufacturer Name: Texas Instruments; Manufacturer Part No.: SN74AVC4T774RSVR
L33-L37 = L-Panasonic-EXC14CH120U-12R@100MHz-1000mA-25%: Common Mode Choke High Speed 12R 100mA; Tolerance: 25%; Rating: 100mA; Manufacturer Name: Panasonic; Manufacturer Part No.: EXC14CH120U; Value: 12R@100MHz
R270 R271 = R-1.8K-63mW-5%-0402: Resistor 1.8 Kohm 63mW 5% 0402; Rating: 63mW; Tolerance: 5%; Value: 1.8K
R272 R273 R287 = R-10K-63mW-5%-0402: Resistor 10 Kohm 63mW 5% 0402; Rating: 63mW; Tolerance: 5%; Value: 10K
R274 R275 R278-R281 = R-0R-63mW-1%-0603: Resistor 0 ohm 63mW 1% 0603; Rating: 63mW; Tolerance: 1%; Value: 0R
R282-R285 = R-100K-63mW-5%-0402: Resistor 100 Kohm 63mW 5% 0402; Rating: 63mW; Tolerance: 5%; Value: 100K
RA22 = RA-22R-63mW-5%-1206-div: Resistor Array 22 R 63mW 5% 1206; Tolerance: 5%; Power Dissipation: 63mW; Value: 22R
X1 = CON-TE-2309409-2: as X1 on sheet PCI_Express; Temperature Range: -40C to +125C; Package: DDR4-SODIMM-260; Manufacturer Part No.: 2309409-2
X16 = CON-Hirose-FH12-24S-0.5SVA(54)-0.5mm: 0.50mm Pitch FFC/FPC Vertical DVI Connector; Manufacturer Name: Hirose; No. of ways: 24; Pitch: 0.5mm; Manufacturer Part No.: FH12-24S-0.5SVA(54)

## Sheet PWM_QSPI_SPI_ADC_UART_GPIO_I2C.SchDoc: Dahlia Carrier Board
size A3; Organization: Toradex AG; Address1: Ebenaustrasse 10; Address2: Horw; Address3: 6048; Address4: Switzerland; DocumentNumber: 17; Revision: V1.1; SheetNumber: 17; SheetTotal: 21; PageSetup: Record=PageOptions|CenterHorizontal=True|CenterVertical=True|PrintScale=0.71|XCorrection=1.00|YCorrection=1.00|PrintKind=1|BorderSize=5000000|LeftOffset=0|BottomOffset=0|Orientation=2|PaperLength=1000|PaperWidth=1000|Scale=100|PaperSource=15|PrintQuality=600|MediaType=1|DitherType=10|PaperKind=A4|PrintScaleMode=1
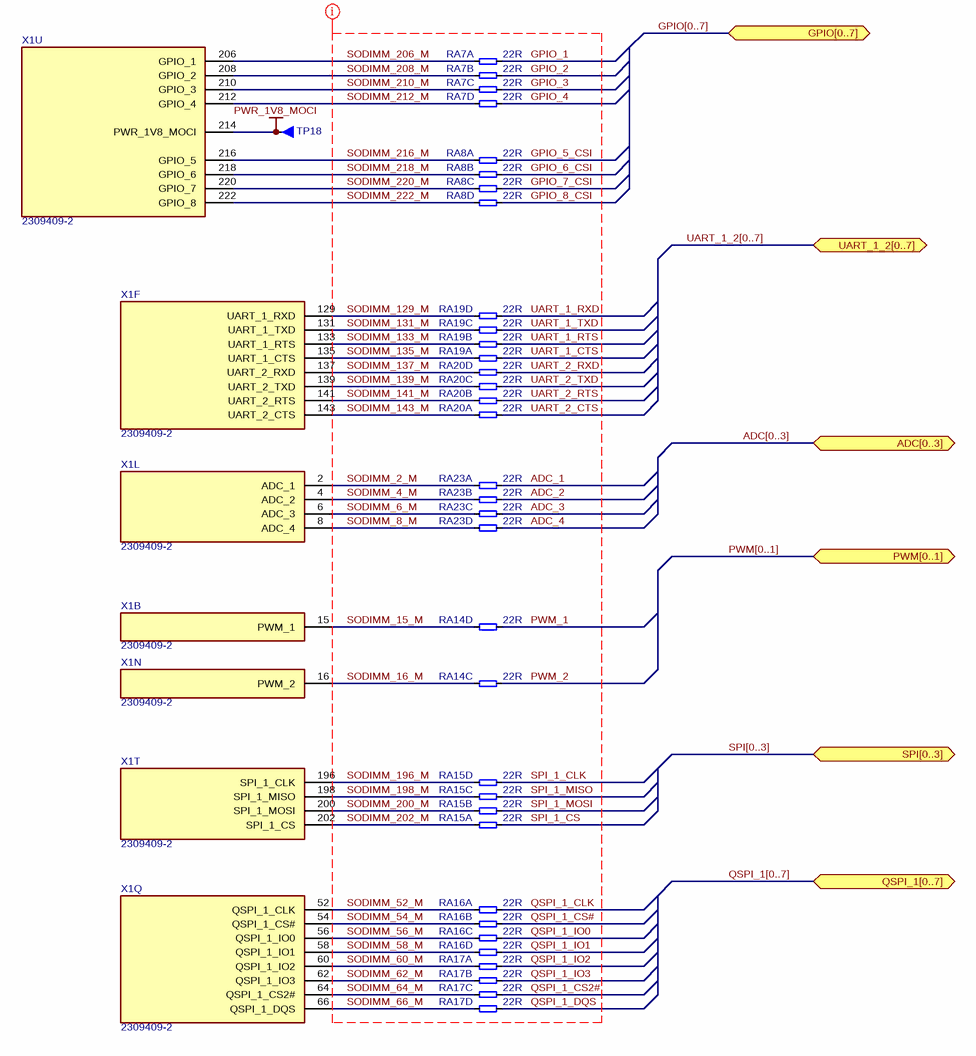
[diagram p15: PWM_QSPI_SPI_ADC_UART_GPIO_I2C.SchDoc]

### Parts
RA7  22R  [T_Resistor_Array_X4]  (parts A,B,C,D of 4)
RA8  22R  [T_Resistor_Array_X4]  (parts A,B,C,D of 4)
RA14  22R  [T_Resistor_Array_X4]  (parts C,D of 4)
RA15  22R  [T_Resistor_Array_X4]  (parts A,B,C,D of 4)
RA16  22R  [T_Resistor_Array_X4]  (parts A,B,C,D of 4)
RA17  22R  [T_Resistor_Array_X4]  (parts A,B,C,D of 4)
RA19  22R  [T_Resistor_Array_X4]  (parts A,B,C,D of 4)
RA20  22R  [T_Resistor_Array_X4]  (parts A,B,C,D of 4)
RA23  22R  [T_Resistor_Array_X4]  (parts A,B,C,D of 4)
TP18  Testpin-THT  [T_TP-THT]  (value not drawn)  (no BOM)
X1  2309409-2  [CON-TE-2309409-2-SOLDERABLE-STANDOFFS]  (parts B,F,L,N,Q,T,U of 23)

### Ports
ADC[0..3] (bidir), GPIO[0..7] (bidir), PWM[0..1] (bidir), QSPI_1[0..7] (bidir), SPI[0..3] (bidir), UART_1_2[0..7] (bidir)

### Nets
PWR_1V8_MOCI: TP18.1 X1.214(PWR_1V8_MOCI)
ADC_1: RA23.5
ADC_2: RA23.6
ADC_3: RA23.7
ADC_4: RA23.8
GPIO_1: RA7.5
GPIO_2: RA7.6
GPIO_3: RA7.7
GPIO_4: RA7.8
GPIO_5_CSI: RA8.5
GPIO_6_CSI: RA8.6
GPIO_7_CSI: RA8.7
GPIO_8_CSI: RA8.8
PWM_1: RA14.8
PWM_2: RA14.7
QSPI_1_CLK: RA16.5
QSPI_1_CS2#: RA17.7
QSPI_1_CS#: RA16.6
QSPI_1_DQS: RA17.8
QSPI_1_IO0: RA16.7
QSPI_1_IO1: RA16.8
QSPI_1_IO2: RA17.5
QSPI_1_IO3: RA17.6
SODIMM_2_M: RA23.1 X1.2(ADC_1)
SODIMM_4_M: RA23.2 X1.4(ADC_2)
SODIMM_6_M: RA23.3 X1.6(ADC_3)
SODIMM_8_M: RA23.4 X1.8(ADC_4)
SODIMM_15_M: RA14.4 X1.15(PWM_1)
SODIMM_16_M: RA14.3 X1.16(PWM_2)
SODIMM_52_M: RA16.1 X1.52(QSPI_1_CLK)
SODIMM_54_M: RA16.2 X1.54(QSPI_1_CS#)
SODIMM_56_M: RA16.3 X1.56(QSPI_1_IO0)
SODIMM_58_M: RA16.4 X1.58(QSPI_1_IO1)
SODIMM_60_M: RA17.1 X1.60(QSPI_1_IO2)
SODIMM_62_M: RA17.2 X1.62(QSPI_1_IO3)
SODIMM_64_M: RA17.3 X1.64(QSPI_1_CS2#)
SODIMM_66_M: RA17.4 X1.66(QSPI_1_DQS)
SODIMM_129_M: RA19.4 X1.129(UART_1_RXD)
SODIMM_131_M: RA19.3 X1.131(UART_1_TXD)
SODIMM_133_M: RA19.2 X1.133(UART_1_RTS)
SODIMM_135_M: RA19.1 X1.135(UART_1_CTS)
SODIMM_137_M: RA20.4 X1.137(UART_2_RXD)
SODIMM_139_M: RA20.3 X1.139(UART_2_TXD)
SODIMM_141_M: RA20.2 X1.141(UART_2_RTS)
SODIMM_143_M: RA20.1 X1.143(UART_2_CTS)
SODIMM_196_M: RA15.4 X1.196(SPI_1_CLK)
SODIMM_198_M: RA15.3 X1.198(SPI_1_MISO)
SODIMM_200_M: RA15.2 X1.200(SPI_1_MOSI)
SODIMM_202_M: RA15.1 X1.202(SPI_1_CS)
SODIMM_206_M: RA7.1 X1.206(GPIO_1)
SODIMM_208_M: RA7.2 X1.208(GPIO_2)
SODIMM_210_M: RA7.3 X1.210(GPIO_3)
SODIMM_212_M: RA7.4 X1.212(GPIO_4)
SODIMM_216_M: RA8.1 X1.216(GPIO_5)
SODIMM_218_M: RA8.2 X1.218(GPIO_6)
SODIMM_220_M: RA8.3 X1.220(GPIO_7)
SODIMM_222_M: RA8.4 X1.222(GPIO_8)
SPI_1_CLK: RA15.8
SPI_1_CS: RA15.5
SPI_1_MISO: RA15.7
SPI_1_MOSI: RA15.6
UART_1_CTS: RA19.5
UART_1_RTS: RA19.6
UART_1_RXD: RA19.8
UART_1_TXD: RA19.7
UART_2_CTS: RA20.5
UART_2_RTS: RA20.6
UART_2_RXD: RA20.8
UART_2_TXD: RA20.7

### Buses and harness runs
bus ADC[0..3] = port ADC[0..3]
bus GPIO[0..7] = port GPIO[0..7]
bus PWM[0..1] = port PWM[0..1]
bus QSPI_1[0..7] = port QSPI_1[0..7]
bus SPI[0..3] = port SPI[0..3]
bus UART_1_2[0..7] = port UART_1_2[0..7]

### Layout directives
net class 50Ohm: ADC_1, ADC_2, ADC_3, ADC_4, GPIO_1, GPIO_2, GPIO_3, GPIO_4, GPIO_5_CSI, GPIO_6_CSI, GPIO_7_CSI, GPIO_8_CSI, PWM_1, PWM_2, QSPI_1_CLK, QSPI_1_CS2#, QSPI_1_CS#, QSPI_1_DQS, QSPI_1_IO0, QSPI_1_IO1, QSPI_1_IO2, QSPI_1_IO3, SODIMM_2_M, SODIMM_4_M, SODIMM_6_M, SODIMM_8_M, SODIMM_15_M, SODIMM_16_M, SODIMM_52_M, SODIMM_54_M, SODIMM_56_M, SODIMM_58_M, SODIMM_60_M, SODIMM_62_M, SODIMM_64_M, SODIMM_66_M, SODIMM_129_M, SODIMM_131_M, SODIMM_133_M, SODIMM_135_M, SODIMM_137_M, SODIMM_139_M, SODIMM_141_M, SODIMM_143_M, SODIMM_196_M, SODIMM_198_M, SODIMM_200_M, SODIMM_202_M, SODIMM_206_M, SODIMM_208_M, SODIMM_210_M, SODIMM_212_M, SODIMM_216_M, SODIMM_218_M, SODIMM_220_M, SODIMM_222_M, SPI_1_CLK, SPI_1_CS, SPI_1_MISO, SPI_1_MOSI, UART_1_CTS, UART_1_RTS, UART_1_RXD, UART_1_TXD, UART_2_CTS, UART_2_RTS, UART_2_RXD, UART_2_TXD

### Notes on the sheet
- Title
- Size:
- Date:
- A3
- Number:
- Time:
- Revision:
- Sheet
- of
- File:

### Library data of the parts
RA7 RA8 RA14-RA17 RA19 RA20 RA23 = RA-22R-63mW-5%-1206-div: Resistor Array 22 R 63mW 5% 1206; Tolerance: 5%; Power Dissipation: 63mW; Value: 22R
TP18 = Testpin-THT: Testpin THT
X1 = CON-TE-2309409-2: as X1 on sheet PCI_Express; Temperature Range: -40C to +125C; Package: DDR4-SODIMM-260; Manufacturer Part No.: 2309409-2

## Sheet EEPROM.SchDoc: Dahlia Carrier Board
size A3; Organization: Toradex AG; Address1: Ebenaustrasse 10; Address2: Horw; Address3: 6048; Address4: Switzerland; DocumentNumber: 16; Revision: V1.1; SheetNumber: 16; SheetTotal: 21; PageSetup: Record=PageOptions|CenterHorizontal=True|CenterVertical=True|PrintScale=0.71|XCorrection=1.00|YCorrection=1.00|PrintKind=1|BorderSize=5000000|LeftOffset=0|BottomOffset=0|Orientation=2|PaperLength=1000|PaperWidth=1000|Scale=100|PaperSource=15|PrintQuality=600|MediaType=1|DitherType=10|PaperKind=A4|PrintScaleMode=1
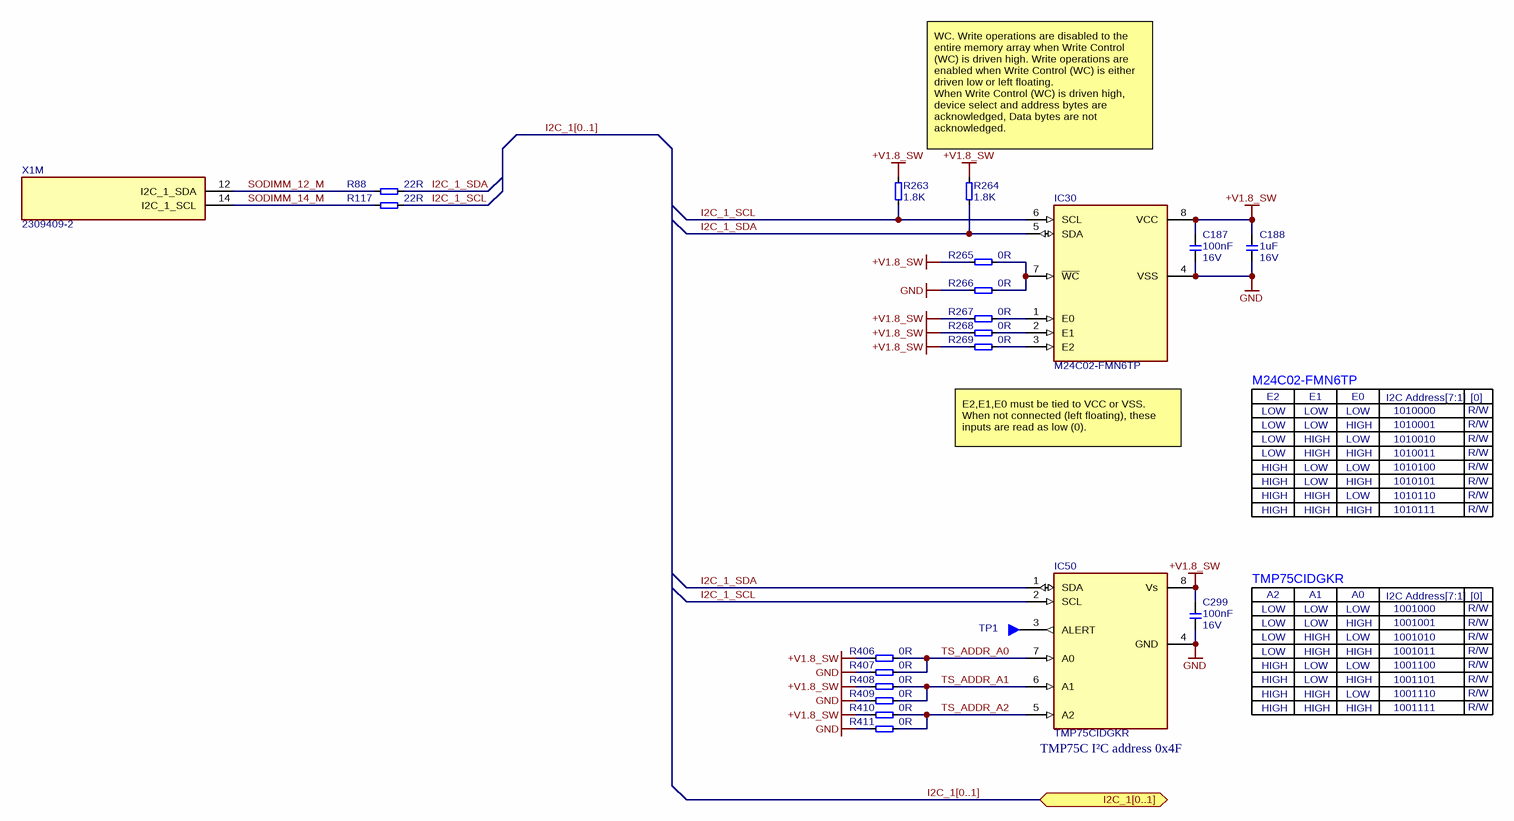
[diagram p16: EEPROM.SchDoc]

### Parts
C187  Rating: 16V  [CAPC1005X60N]  (hidden comment: 100nF)
C188  Rating: 16V  [CAPC1005X60N]  (hidden comment: 1uF)
C299  Rating: 16V  [CAPC1005X60N]  (hidden comment: 100nF)
IC30  M24C02-FMN6TP  [IC-SOIC-8N]
IC50  TMP75CIDGKR  [IC-TSOP65P490X110-8N]
R88  22R  [RESC1005X40N]
R117  22R  [RESC1005X40N]
R263  1.8K  [RESC1005X40N]
R264  1.8K  [RESC1005X40N]
R265  0R  [T_RESC0603X30N]
R266  0R  [T_RESC0603X30N]
R267  0R  [T_RESC0603X30N]
R268  0R  [T_RESC0603X30N]
R269  0R  [T_RESC0603X30N]
R406  0R  [T_RESC0603X30N]
R407  0R  [T_RESC0603X30N]
R408  0R  [T_RESC0603X30N]
R409  0R  [T_RESC0603X30N]
R410  0R  [T_RESC0603X30N]
R411  0R  [T_RESC0603X30N]
TP1  Testpin-SMD  [T_TP-SMD]  (value not drawn)  (no BOM)
X1  2309409-2  [CON-TE-2309409-2-SOLDERABLE-STANDOFFS]  (part M of 23)

### Ports
I2C_1[0..1] (bidir)

### Nets
+V1.8_SW: C187.2 C188.2 C299.2 IC30.8(VCC) IC50.8(Vs) R263.1 R264.1 R265.1 R267.1 R268.1 R269.1 R406.1 R408.1 R410.1
GND: C187.1 C188.1 C299.1 IC30.4(VSS) IC50.4(GND) R266.1 R407.1 R409.1 R411.1
I2C_1_SCL: IC30.6(SCL) IC50.2(SCL) R117.2 R263.2
I2C_1_SDA: IC30.5(SDA) IC50.1(SDA) R88.2 R264.2
SODIMM_12_M: R88.1 X1.12(I2C_1_SDA)
SODIMM_14_M: R117.1 X1.14(I2C_1_SCL)
TS_ADDR_A0: IC50.7(A0) R406.2 R407.2
TS_ADDR_A1: IC50.6(A1) R408.2 R409.2
TS_ADDR_A2: IC50.5(A2) R410.2 R411.2
NetIC30_1: IC30.1(E0) R267.2
NetIC30_2: IC30.2(E1) R268.2
NetIC30_3: IC30.3(E2) R269.2
NetIC30_7: IC30.7(~{WC}) R265.2 R266.2
NetIC50_3: IC50.3(ALERT) TP1.1

### Buses and harness runs
bus I2C_1[0..1] = port I2C_1[0..1]

### Notes on the sheet
- WC. Write operations are disabled to the entire memory array when Write Control (WC) is driven high. Write operations are enabled when Write Control (WC) is either driven low or left floating.
  When Write Control (WC) is driven high, device select and address bytes are acknowledged, Data bytes are not acknowledged.
- E2,E1,E0 must be tied to VCC or VSS. When not connected (left floating), these inputs are read as low (0).
- M24C02-FMN6TP
- LOW
- E2
- HIGH
- E1
- E0
- I2C Address[7:1]
- 1010000
- 1010001
- 1010010
- R/W
- [0]
- 1010011
- 1010100
- 1010101
- 1010110
- 1010111
- TMP75CIDGKR
- A2
- A1
- A0
- 1001000
- 1001001
- 1001010
- 1001011
- 1001100
- 1001101
- 1001110
- 1001111
- (near IC50) TMP75C I²C address 0x4F
- Title
- Size:
- Date:
- A3
- Number:
- Time:
- Revision:
- Sheet
- of
- File:

### Library data of the parts
C187 C299 = C-X7R-100nF-16V-10%-0402: Capacitor Ceramic X7R 100nF 16V 10% 0402; Tolerance: 10%; Type: X7R; Value: 100nF
C188 = C-X5R-1uF-16V-20%-0402: Capacitor Ceramic X5R 1uF 16V 20% 0402; Tolerance: 20%; Type: X5R; Value: 1uF
IC30 = IC-ST-M24C02-FMN6TP: EEPROM, Serial I²C bus , SOIC-8, -40C to +85C; Manufacturer Name: ST; Temperature Range: -40C to +85C; Package: SOIC-8 (3.9mm x4.9 mm); Manufacturer Part No.: M24C02-FMN6TP
IC50 = IC-TI-TMP75CIDGKR: Temperature Sensor Digital, Local -55°C ~ 125°C 11 b 8-VSSOP; Manufacturer Name: Texas Instruments; Manufacturer Part No.: TMP75CIDGKR
R88 R117 = R-22R-63mW-5%-0402: Resistor 22 ohm 63mW 5% 0402; Rating: 63mW; Tolerance: 5%; Value: 22R
R263 R264 = R-1.8K-63mW-5%-0402: Resistor 1.8 Kohm 63mW 5% 0402; Rating: 63mW; Tolerance: 5%; Value: 1.8K
R265-R269 R406-R411 = R-0R-63mW-1%-0603: Resistor 0 ohm 63mW 1% 0603; Rating: 63mW; Tolerance: 1%; Value: 0R
TP1 = Testpin-SMD: Testpin SMD
X1 = CON-TE-2309409-2: as X1 on sheet PCI_Express; Temperature Range: -40C to +125C; Package: DDR4-SODIMM-260; Manufacturer Part No.: 2309409-2